# Altium project THE_FIRST.PrjPcb (part 1 of 2)
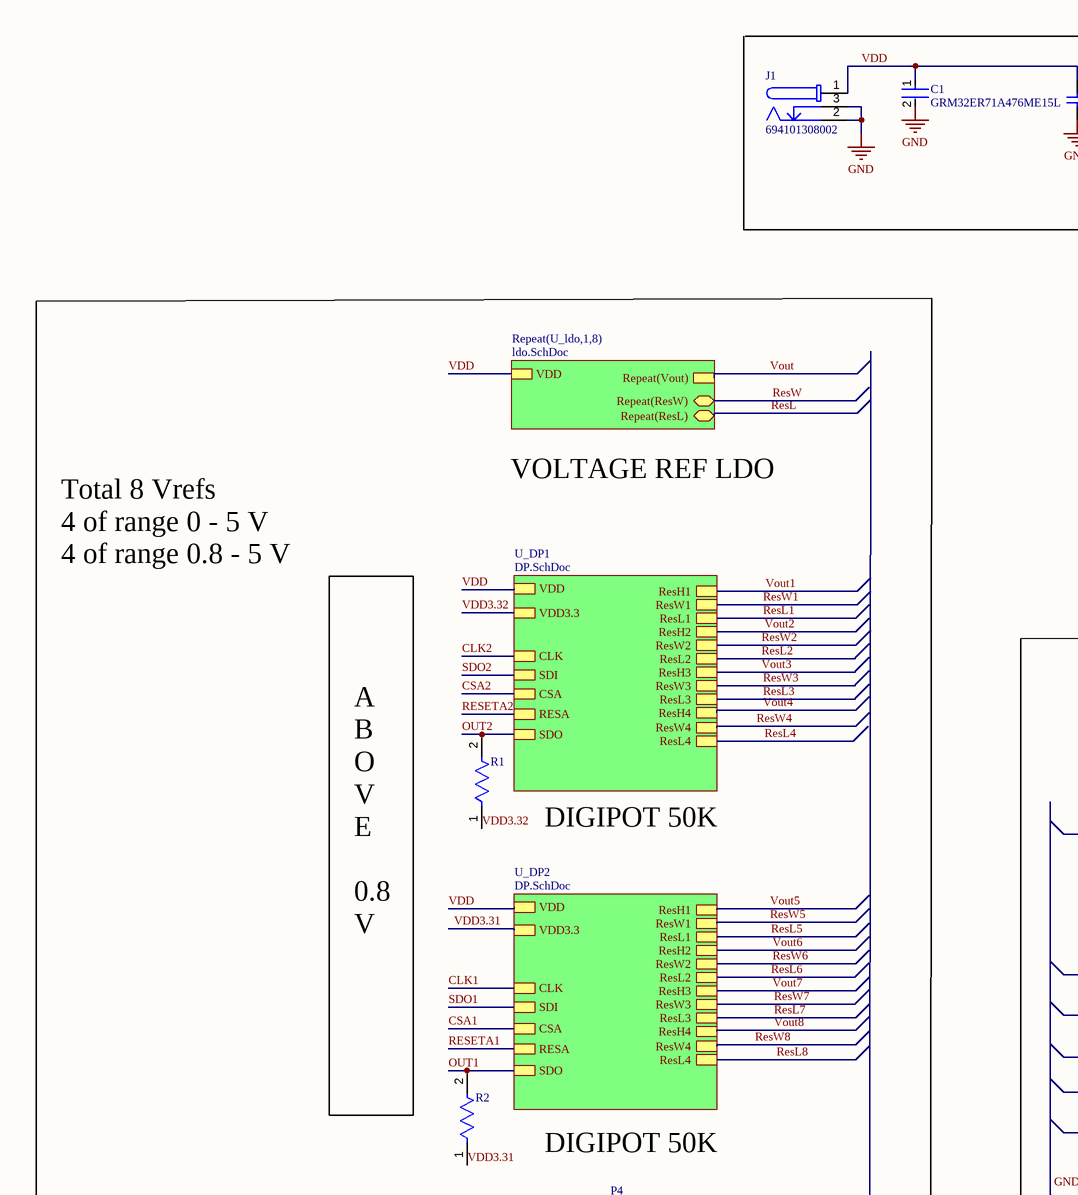
[diagram p0: THE_FIRST.SchDoc, top left]
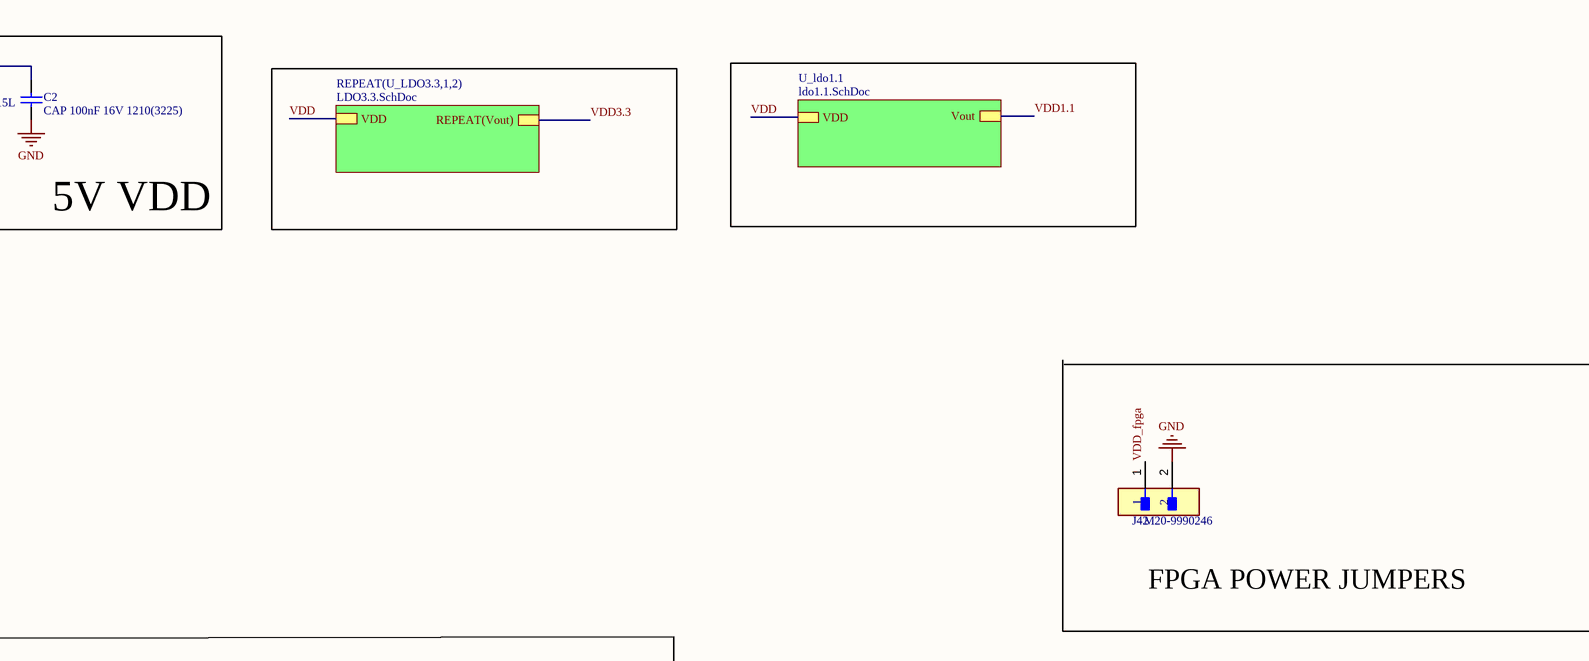
[diagram p1: THE_FIRST.SchDoc, top right]
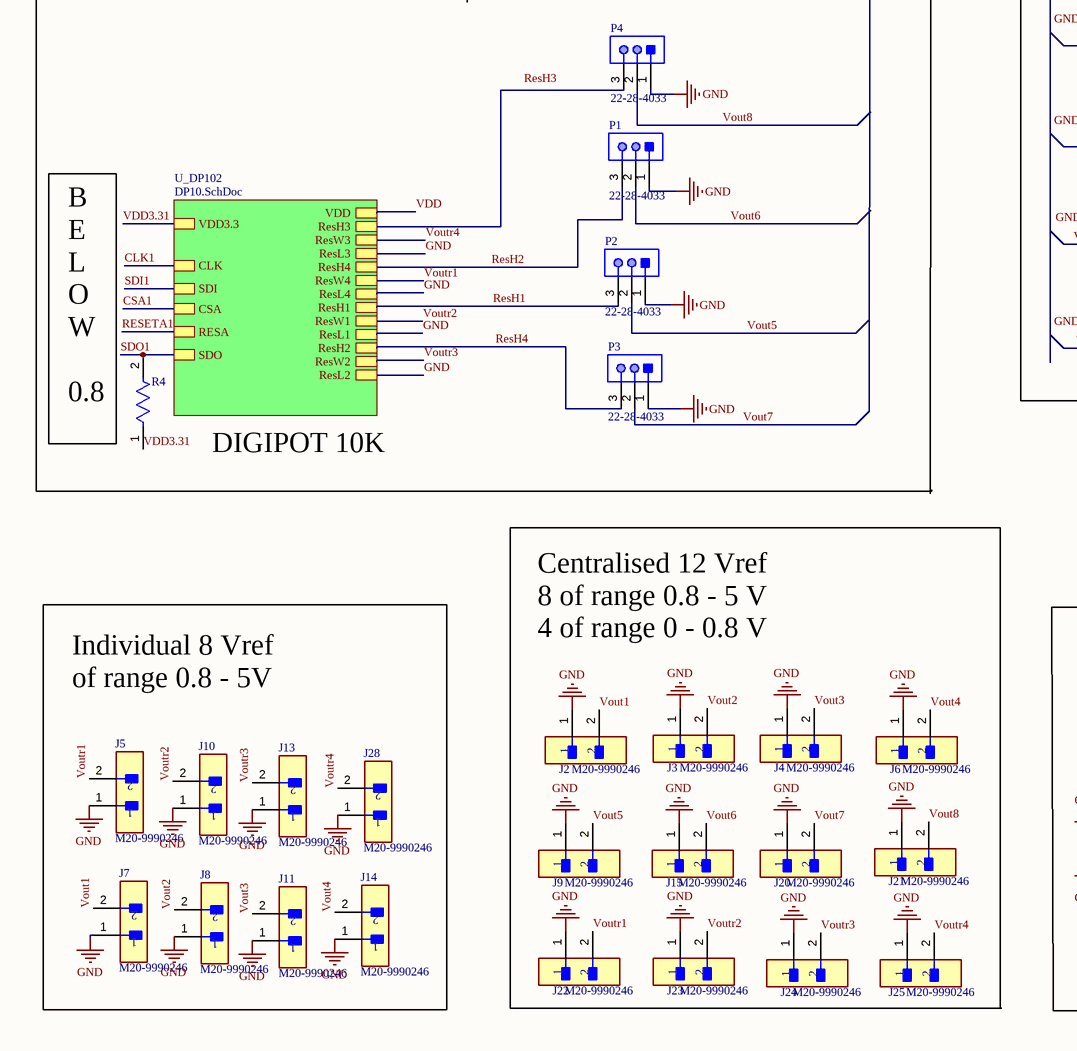
[diagram p2: THE_FIRST.SchDoc, bottom left]
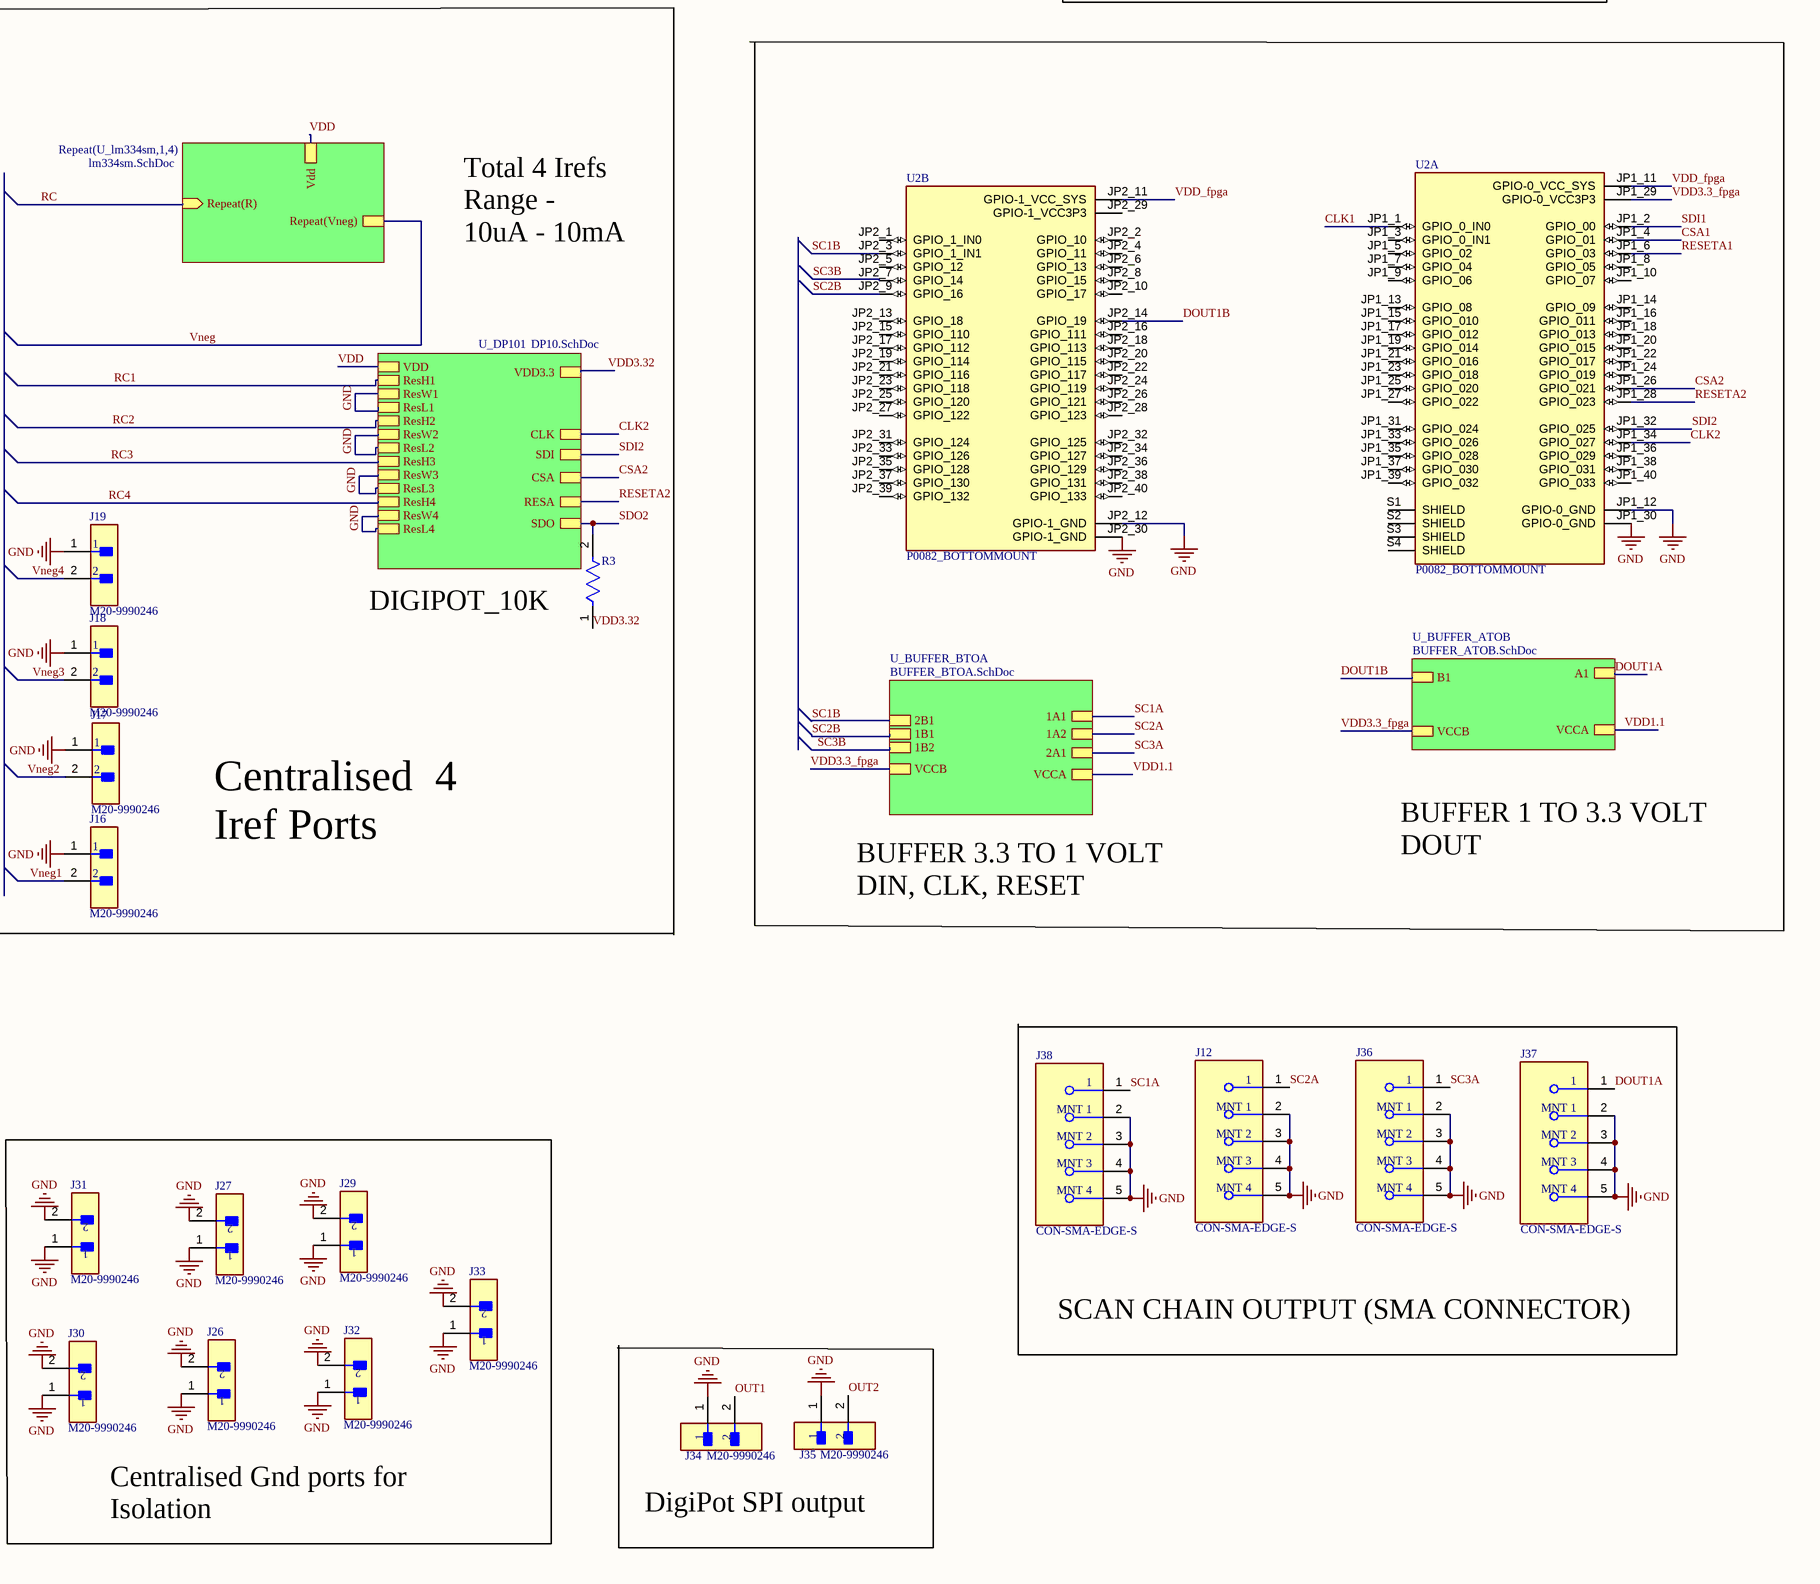
[diagram p3: THE_FIRST.SchDoc, bottom right]
9 sheets, 156 parts. Net scope: hierarchical (ports join the sheet entries above them; power ports are global).
Board file: THE_FIRST.PcbDoc
Sheets:
  THE_FIRST.SchDoc
    U_ldo1 = ldo.SchDoc
    U_ldo2 = ldo.SchDoc
    U_ldo3 = ldo.SchDoc
    U_ldo4 = ldo.SchDoc
    U_ldo5 = ldo.SchDoc
    U_ldo6 = ldo.SchDoc
    U_ldo7 = ldo.SchDoc
    U_ldo8 = ldo.SchDoc
    U_DP1 = DP.SchDoc
    U_DP2 = DP.SchDoc
    U_lm334sm1 = lm334sm.SchDoc
    U_lm334sm2 = lm334sm.SchDoc
    U_lm334sm3 = lm334sm.SchDoc
    U_lm334sm4 = lm334sm.SchDoc
    U_DP101 = DP10.SchDoc
    U_DP102 = DP10.SchDoc
    U_LDO3.31 = LDO3.3.SchDoc
    U_LDO3.32 = LDO3.3.SchDoc
    U_ldo1.1 = ldo1.1.SchDoc
    U_BUFFER_ATOB = BUFFER_ATOB.SchDoc
    U_BUFFER_BTOA = BUFFER_BTOA.SchDoc

## Sheet THE_FIRST.SchDoc
size 558 x 431 mm; DocumentNumber: 1; SheetNumber: 1; SheetTotal: 9

### Parts
C1  GRM32ER71A476ME15L  [FP-GRM32E-0_3-0_2-IPC_A]
C2  CAP 100nF 16V 1210(3225)  [CAPC1210(3225)115_M]
J1  694101308002  [694101308002]
J2  M20-9990246  [FP-M20-9990246-MFG]
J3  M20-9990246  [FP-M20-9990246-MFG]
J4  M20-9990246  [FP-M20-9990246-MFG]
J5  M20-9990246  [FP-M20-9990246-MFG]
J6  M20-9990246  [FP-M20-9990246-MFG]
J7  M20-9990246  [FP-M20-9990246-MFG]
J8  M20-9990246  [FP-M20-9990246-MFG]
J9  M20-9990246  [FP-M20-9990246-MFG]
J10  M20-9990246  [FP-M20-9990246-MFG]
J11  M20-9990246  [FP-M20-9990246-MFG]
J12  CON-SMA-EDGE-S  [FP-CON-SMA-EDGE-S-MFG]
J13  M20-9990246  [FP-M20-9990246-MFG]
J14  M20-9990246  [FP-M20-9990246-MFG]
J15  M20-9990246  [FP-M20-9990246-MFG]
J16  M20-9990246  [FP-M20-9990246-MFG]
J17  M20-9990246  [FP-M20-9990246-MFG]
J18  M20-9990246  [FP-M20-9990246-MFG]
J19  M20-9990246  [FP-M20-9990246-MFG]
J20  M20-9990246  [FP-M20-9990246-MFG]
J21  M20-9990246  [FP-M20-9990246-MFG]
J22  M20-9990246  [FP-M20-9990246-MFG]
J23  M20-9990246  [FP-M20-9990246-MFG]
J24  M20-9990246  [FP-M20-9990246-MFG]
J25  M20-9990246  [FP-M20-9990246-MFG]
J26  M20-9990246  [FP-M20-9990246-MFG]
J27  M20-9990246  [FP-M20-9990246-MFG]
J28  M20-9990246  [FP-M20-9990246-MFG]
J29  M20-9990246  [FP-M20-9990246-MFG]
J30  M20-9990246  [FP-M20-9990246-MFG]
J31  M20-9990246  [FP-M20-9990246-MFG]
J32  M20-9990246  [FP-M20-9990246-MFG]
J33  M20-9990246  [FP-M20-9990246-MFG]
J34  M20-9990246  [FP-M20-9990246-MFG]
J35  M20-9990246  [FP-M20-9990246-MFG]
J36  CON-SMA-EDGE-S  [FP-CON-SMA-EDGE-S-MFG]
J37  CON-SMA-EDGE-S  [FP-CON-SMA-EDGE-S-MFG]
J38  CON-SMA-EDGE-S  [FP-CON-SMA-EDGE-S-MFG]
J42  M20-9990246  [FP-M20-9990246-MFG]
P1  22-28-4033  [MOLX-22-28-4033_V]
P2  22-28-4033  [MOLX-22-28-4033_V]
P3  22-28-4033  [MOLX-22-28-4033_V]
P4  22-28-4033  [MOLX-22-28-4033_V]
R1  ERA-2AEB222X  [FP-ERA2A-MFG]  (value not drawn)
R2  ERA-2AEB222X  [FP-ERA2A-MFG]  (value not drawn)
R3  ERA-2AEB222X  [FP-ERA2A-MFG]  (value not drawn)
R4  ERA-2AEB222X  [FP-ERA2A-MFG]  (value not drawn)
U2  P0082_BOTTOMMOUNT  [MODULE_P0082_BOTTOMMOUNT]  (parts A,B of 2)

### Sub-sheets
REPEAT(U_LDO3.3,1,2) = LDO3.3.SchDoc: VDD, REPEAT(Vout)
Repeat(U_ldo,1,8) = ldo.SchDoc: VDD, Repeat(Vout), Repeat(ResW) (bidir), Repeat(ResL) (bidir)
Repeat(U_lm334sm,1,4) = lm334sm.SchDoc: Vdd, Repeat(R) (in), Repeat(Vneg)
U_BUFFER_ATOB = BUFFER_ATOB.SchDoc: B1, A1, VCCA, VCCB
U_BUFFER_BTOA = BUFFER_BTOA.SchDoc: VCCA, 2B1, 1B1, 1B2, 2A1, 1A1, 1A2, VCCB
U_DP1 = DP.SchDoc: VDD, ResH1, ResW1, ResL1, ResH2, ResW2, ResL2, ResH3, ResW3, ResL3, ResH4, ResW4, ResL4, VDD3.3, CLK, SDI, CSA, RESA, SDO
U_DP2 = DP.SchDoc: VDD, ResH1, ResW1, ResL1, ResH2, ResW2, ResL2, ResH3, ResW3, ResL3, ResH4, ResW4, ResL4, VDD3.3, CLK, SDI, CSA, RESA, SDO
U_DP101 = DP10.SchDoc: VDD, ResH1, ResW1, ResL1, ResH2, ResW2, ResL2, ResH3, ResW3, ResL3, ResH4, ResW4, ResL4, VDD3.3, CLK, SDI, CSA, RESA, SDO
U_DP102 = DP10.SchDoc: VDD, ResH3, ResW3, ResL3, ResH4, ResW4, ResL4, ResH1, ResW1, ResL1, ResH2, ResW2, ResL2, VDD3.3, CLK, SDI, CSA, RESA, SDO
U_ldo1.1 = ldo1.1.SchDoc: VDD, Vout

### Nets
GND: C1.2 C2.1 J1.2 J1.3 J2.1 J3.1 J4.1 J5.1 J6.1 J7.1 J8.1 J9.1 J10.1 J11.1 J12.2(MNT_1) J12.3(MNT_2) J12.4(MNT_3) J12.5(MNT_4) J13.1 J14.1 J15.1 J16.1 J17.1 J18.1 J19.1 J20.1 J21.1 J22.1 J23.1 J24.1 J25.1 J26.1 J26.2 J27.1 J27.2 J28.1 J29.1 J29.2 J30.1 J30.2 J31.1 J31.2 J32.1 J32.2 J33.1 J33.2 J34.1 J35.1 J36.2(MNT_1) J36.3(MNT_2) J36.4(MNT_3) J36.5(MNT_4) J37.2(MNT_1) J37.3(MNT_2) J37.4(MNT_3) J37.5(MNT_4) J38.2(MNT_1) J38.3(MNT_2) J38.4(MNT_3) J38.5(MNT_4) J42.2 P1.1 P2.1 P3.1 P4.1 U2.JP1_12(GPIO-0_GND) U2.JP1_30(GPIO-0_GND) U2.JP2_12(GPIO-1_GND) U2.JP2_30(GPIO-1_GND) ; sheet U_DP101/ResW1, sheet U_DP101/ResL1, sheet U_DP101/ResW2, sheet U_DP101/ResL2, sheet U_DP101/ResW3, sheet U_DP101/ResL3, sheet U_DP101/ResW4, sheet U_DP101/ResL4, sheet U_DP102/ResL3, sheet U_DP102/ResL4, sheet U_DP102/ResL1, sheet U_DP102/ResL2
CLK1: U2.JP1_1(GPIO_0_IN0) ; sheet U_DP2/CLK, sheet U_DP102/CLK
CLK2: U2.JP1_34(GPIO_027) ; sheet U_DP1/CLK, sheet U_DP101/CLK
CSA1: U2.JP1_4(GPIO_01) ; sheet U_DP2/CSA, sheet U_DP102/CSA
CSA2: U2.JP1_26(GPIO_021) ; sheet U_DP1/CSA, sheet U_DP101/CSA
DOUT1A: J37.1 ; sheet U_BUFFER_ATOB/A1
DOUT1B: U2.JP2_14(GPIO_19) ; sheet U_BUFFER_ATOB/B1
OUT1: J34.2 R2.2 ; sheet U_DP2/SDO
OUT2: J35.2 R1.2 ; sheet U_DP1/SDO
RC: sheet Repeat(U_lm334sm,1,4)/Repeat(R)
RESETA1: U2.JP1_6(GPIO_03) ; sheet U_DP2/RESA, sheet U_DP102/RESA
RESETA2: U2.JP1_28(GPIO_023) ; sheet U_DP1/RESA, sheet U_DP101/RESA
ResH1: P2.3 ; sheet U_DP102/ResH1
ResH2: P1.3 ; sheet U_DP102/ResH4
ResH3: P4.3 ; sheet U_DP102/ResH3
ResH4: P3.3 ; sheet U_DP102/ResH2
ResL: sheet Repeat(U_ldo,1,8)/Repeat(ResL)
ResL1: sheet U_DP1/ResW1, sheet U_DP1/ResL1  [also labelled ResW1]
ResL2: sheet U_DP1/ResW2, sheet U_DP1/ResL2  [also labelled ResW2]
ResL3: sheet U_DP1/ResW3, sheet U_DP1/ResL3  [also labelled ResW3]
ResL4: sheet U_DP1/ResW4, sheet U_DP1/ResL4  [also labelled ResW4]
ResL5: sheet U_DP2/ResW1, sheet U_DP2/ResL1  [also labelled ResW5]
ResL6: sheet U_DP2/ResW2, sheet U_DP2/ResL2  [also labelled ResW6]
ResL7: sheet U_DP2/ResW3, sheet U_DP2/ResL3  [also labelled ResW7]
ResL8: sheet U_DP2/ResW4, sheet U_DP2/ResL4  [also labelled ResW8]
ResW: sheet Repeat(U_ldo,1,8)/Repeat(ResW)
SC1A: J38.1 ; sheet U_BUFFER_BTOA/1A1
SC1B: U2.JP2_3(GPIO_1_IN1) ; sheet U_BUFFER_BTOA/2B1
SC2A: J12.1 ; sheet U_BUFFER_BTOA/1A2
SC2B: U2.JP2_9(GPIO_16) ; sheet U_BUFFER_BTOA/1B1
SC3A: J36.1 ; sheet U_BUFFER_BTOA/2A1
SC3B: U2.JP2_7(GPIO_14) ; sheet U_BUFFER_BTOA/1B2
SDI1: U2.JP1_2(GPIO_00) ; sheet U_DP102/SDI
SDI2: U2.JP1_32(GPIO_025) ; sheet U_DP101/SDI
SDO1: R4.2 ; sheet U_DP2/SDI, sheet U_DP102/SDO
SDO2: R3.2 ; sheet U_DP1/SDI, sheet U_DP101/SDO
VDD: C1.1 C2.2 J1.1 ; sheet Repeat(U_ldo,1,8)/VDD, sheet U_DP1/VDD, sheet U_DP2/VDD, sheet Repeat(U_lm334sm,1,4)/Vdd, sheet U_DP101/VDD, sheet U_DP102/VDD, sheet REPEAT(U_LDO3.3,1,2)/VDD, sheet U_ldo1.1/VDD
VDD1.1: sheet U_ldo1.1/Vout, sheet U_BUFFER_ATOB/VCCA, sheet U_BUFFER_BTOA/VCCA
VDD3.3: sheet REPEAT(U_LDO3.3,1,2)/REPEAT(Vout)
VDD3.3_fpga: U2.JP1_29(GPIO-0_VCC3P3) ; sheet U_BUFFER_ATOB/VCCB, sheet U_BUFFER_BTOA/VCCB
VDD3.31: R2.1 R4.1 ; sheet U_DP2/VDD3.3, sheet U_DP102/VDD3.3
VDD3.32: R1.1 R3.1 ; sheet U_DP1/VDD3.3, sheet U_DP101/VDD3.3
VDD_fpga: J42.1 U2.JP1_11(GPIO-0_VCC_SYS) U2.JP2_11(GPIO-1_VCC_SYS)
Vneg: sheet Repeat(U_lm334sm,1,4)/Repeat(Vneg)
Vneg1: J16.2
Vneg2: J17.2
Vneg3: J18.2
Vneg4: J19.2
Vout: sheet Repeat(U_ldo,1,8)/Repeat(Vout)
Vout1: J2.2 J7.2 ; sheet U_DP1/ResH1
Vout2: J3.2 J8.2 ; sheet U_DP1/ResH2
Vout3: J4.2 J11.2 ; sheet U_DP1/ResH3
Vout4: J6.2 J14.2 ; sheet U_DP1/ResH4
Vout5: J9.2 P2.2 ; sheet U_DP2/ResH1
Vout6: J15.2 P1.2 ; sheet U_DP2/ResH2
Vout7: J20.2 P3.2 ; sheet U_DP2/ResH3
Vout8: J21.2 P4.2 ; sheet U_DP2/ResH4
Voutr1: J5.2 J22.2 ; sheet U_DP102/ResW4
Voutr2: J10.2 J23.2 ; sheet U_DP102/ResW1
Voutr3: J13.2 J24.2 ; sheet U_DP102/ResW2
Voutr4: J25.2 J28.2 ; sheet U_DP102/ResW3

Not connected (* = marked no-connect by the designer): U2 JP1_3(GPIO_0_IN1) JP1_5(GPIO_02) JP1_7(GPIO_04) JP1_8(GPIO_05) JP1_9(GPIO_06) JP1_10(GPIO_07) JP1_13(GPIO_08) JP1_14(GPIO_09) JP1_15(GPIO_010) JP1_16(GPIO_011) JP1_17(GPIO_012) JP1_18(GPIO_013) JP1_19(GPIO_014) JP1_20(GPIO_015) JP1_21(GPIO_016) JP1_22(GPIO_017) JP1_23(GPIO_018) JP1_24(GPIO_019) JP1_25(GPIO_020) JP1_27(GPIO_022) JP1_31(GPIO_024) JP1_33(GPIO_026) JP1_35(GPIO_028) JP1_36(GPIO_029) JP1_37(GPIO_030) JP1_38(GPIO_031) JP1_39(GPIO_032) JP1_40(GPIO_033) JP2_1(GPIO_1_IN0) JP2_2(GPIO_10) JP2_4(GPIO_11) JP2_5(GPIO_12) JP2_6(GPIO_13) JP2_8(GPIO_15) JP2_10(GPIO_17) JP2_13(GPIO_18) JP2_15(GPIO_110) JP2_16(GPIO_111) JP2_17(GPIO_112) JP2_18(GPIO_113) JP2_19(GPIO_114) JP2_20(GPIO_115) JP2_21(GPIO_116) JP2_22(GPIO_117) JP2_23(GPIO_118) JP2_24(GPIO_119) JP2_25(GPIO_120) JP2_26(GPIO_121) JP2_27(GPIO_122) JP2_28(GPIO_123) JP2_29(GPIO-1_VCC3P3) JP2_31(GPIO_124) JP2_32(GPIO_125) JP2_33(GPIO_126) JP2_34(GPIO_127) JP2_35(GPIO_128) JP2_36(GPIO_129) JP2_37(GPIO_130) JP2_38(GPIO_131) JP2_39(GPIO_132) JP2_40(GPIO_133) S1(SHIELD) S2(SHIELD) S3(SHIELD) S4(SHIELD)

### Notes on the sheet
- 5V VDD
- 3.3V VDD
- 1.1V VDD
- V Refs
- VOLTAGE REF LDO
- Total 8 Vrefs
  4 of range 0 - 5 V
  4 of range 0.8 - 5 V
- FPGA POWER JUMPERS
- CURRENT Refs
- FPGA BOARD
- DIGIPOT 50K
- Total 4 Irefs
  Range -
  10uA - 10mA
- A
  B
  O
  V
  E
  0.8
  V
- (near R3) DIGIPOT_10K
- Centralised  4
  Iref Ports
- BUFFER 3.3 TO 1 VOLT
  DIN, CLK, RESET
- BUFFER 1 TO 3.3 VOLT
  DOUT
- (near R4) B
  E
  L
  O
  W
  0.8
  V
- DIGIPOT 10K
- Centralised 12 Vref
  8 of range 0.8 - 5 V
  4 of range 0 - 0.8 V
- Individual 8 Vref
  of range 0.8 - 5V
- SCAN CHAIN OUTPUT (SMA CONNECTOR)
- Centralised Gnd ports for Isolation
- DigiPot SPI output
- Labels drawn without touching a wire or pin: ResH3
- DWG. NO.
- REV.
- SHT.
- REVISION
- DESCRIPTION
- DATE
- APPROVED
- THIS DOCUMENT AND THE DATA DISCLOSED HEREIN OR HEREWITH IS THE PROPERTY OF ALTIUM LIMITED AND MAY BE FREELY DISTRIBUTED IN WHOLE. NO RIGHTS ARE RESERVED OR EXPRESS OR IMPLIED WARANTEE GIVEN.
- ENG:
- DSN:
- APPROVALS
- PROJECT
- DOCUMENT REVISION:
- DESIGN ITEM:
- CHK:
- BOM:
- REFERENCE DOCUMENTS
- PROJECT REVISION:
- TITLE
- FAB DWG:
- PCB DWG:
- ASSY DWG:
- SCALE:
- SIZE
- C
- CAGE CODE
- FILE NAME
- DWG NO.
- SHEET
- OF
- REV

### Library data of the parts
C1 = CMP-2000-06363-3: Chip Multilayer Ceramic Capacitors for General Purpose, 1210, 47uF, X7R, 15%, 20%, 10V; Voltage Rating (DC): 10V; Lead Free: Lead Free; Capacitance: 47uF; Max Operating Temperature: 125°C; Height: 2.5mm; Min Operating Temperature: -55°C; Length: 3.2mm; Package Quantity: 1; Termination: SMD/SMT; Case Code (Imperial): 1210; Width: 0.098inch; Voltage Rating: 10V; Thickness: 0.106inch; Depth: 2.5mm; REACH SVHC: No SVHC; Packaging: Tape and Reel; Dielectric: X7R; Voltage: 10V; Radiation Hardening: No; Case Code (Metric): 3225; Tolerance: 20%; Case/Package: 1210; Mount: Surface Mount
C2 = CMP-1038-01632-1: CAP 100nF 16V ±1% 1210 (3225 Metric) Thickness 1.1mm SMD; Manufacturer: Panasonic; Manufacturer Part Number: ECH-U1C104GX5; Case-Metric: 3225; Tolerance: Â±1%; Case-EIA: 1210; Dielectric Material: Polyphenylene; Capacitor Type: FILM; Tolerance  (fill in as +-): 2%; Value: 100nF; Technology: SMT; Max Thickness: 1.1 mm; Rated Voltage: 16 V; Supplier: Digikey; Supplier Part Number: PCF1189CT-ND; RoHS: Yes; Category: Film Capacitors; Stock: 18597; Pricing: 1=1, 10=0.637, 50=0.4958, 100=0.4521, 500=0.37836, 1000=0.35557 (USD); Mounting Technology: Surface Mount; Pins: 2; Case/Package: 1210; Package Shape: Rectangular; Terminal Finish: Copper; Min Operating Temperature: -55°C; Max Operating Temperature: 125°C; Package Style: SMTMeter; Packaging: Tape and Reel; Tolerance (fill in as +-): 2%; Rated DC Voltage (URdc): 16V; JESD-609 Code: e1; Termination: Wraparound; Length: 3.2mm; Width: 2.5mm; Height: 2.1mm; Reach SVHC Compliant: Yes; RoHS Compliant: Yes; ComponentLink1URL: https://datasheet.ciiva.com:443/pdfs/VipMasterIC/IC/PANA/PANA-S-A0009590914/PANA-S-A0009590914-1.pdf?src-supplier=IHS+Markit; ComponentLink1Description: https://datasheet.ciiva.com:443/pdfs/VipMasterIC/IC/PANA/PANA-S-A0009590914/PANA-S-A0009590914-1.pdf?src-supplier=IHS+Markit; ComponentLink2URL: https://datasheet.ciiva.com/11792/0900766b8016ecc7-11792269.pdf?src-supplier=Rs; ComponentLink2Description: https://datasheet.ciiva.com/11792/0900766b8016ecc7-11792269.pdf?src-supplier=Rs; ComponentLink3URL: https://datasheet.ciiva.com/11416/abd0000ce13-11416261.pdf?src-supplier=Avnet; ComponentLink3Description: https://datasheet.ciiva.com/11416/abd0000ce13-11416261.pdf?src-supplier=Avnet; ComponentLink4URL: https://datasheet.ciiva.com/30113/21abd0000ce13-30113725.pdf?src-supplier=Onlinecomponents.com; ComponentLink4Description: https://datasheet.ciiva.com/30113/21abd0000ce13-30113725.pdf?src-supplier=Onlinecomponents.com; ComponentLink5URL: https://datasheet.ciiva.com/14606/70067901-14606805.pdf?src-supplier=Allied+Electronics; ComponentLink5Description: https://datasheet.ciiva.com/14606/70067901-14606805.pdf?src-supplier=Allied+Electronics; ComponentLink6URL: https://datasheet.ciiva.com/27055/1981672-27055573.pdf?src-supplier=Jameco; ComponentLink6Description: https://datasheet.ciiva.com/27055/1981672-27055573.pdf?src-supplier=Jameco
J1 = CMP-1502-00182-2: NexarPartId: 52676095; Voltage Rating: 12V; Connector Type: Power; Gender: Male; Insulation Resistance: 100MΩ; Current Rating: 2A; Shielding: Unshielded; Max Operating Temperature: 85°C; Housing Material: Polyamide; RoHS: Compliant; Color: Black; Voltage Rating (DC): 12V; Contact Plating: Tin; Min Operating Temperature: -20°C; Operating Supply Voltage: 12V; REACH SVHC: Unknown; Mount: Through Hole; Termination: Through Hole; Flammability Rating: UL94 V-0; Contact Gender: Male; Packaging: Bulk
J2-J11 J13-J35 J42 = CMP-15831-000009-1: CONN HEADER VERT 2POS 2.54MM; Manufacturer: Harwin; Conn Gender: Male; Conn Orientation: Vertical; Number Of Contacts: 2; Current Rating: 3A; ComponentLink2URL: https://cdn.harwin.com/pdfs/M20-999.pdf; ComponentLink2Description: Datasheet; Package: M20-9990246; Temperature: -40°C to +105°C; Octopart: https://octopart.com/m20-9990246-harwin-2590635; Mouser Description: 2.54mm (0.1") Pitch SIL Vertical PC Tail Pin Header, 6.1mm mating pin height, tin, 2 contacts; Temperature Range High: +105°C; Device Class L1: Connectors; RoHS: TRUE; Automotive: No; Height: 8.99mm; Number Of Rows: 1; Contact Material: Tin,Nickel; Category: Conn; Pitch: 2.54mm; Lead Free: Yes; Digikey Description: CONN HEADER VERT 2POS 2.54MM; Manufacturer Part Number: M20-9990246; Temperature Range Low: -40°C; Device Class L3: unset; Device Class L2: Headers and Wire Housings
J12 J36-J38 = CMP-204357-000001-1: CONN SMA JACK STR EDGE MNT; Manufacturer: RF Solutions Ltd.; Impedance: 50Ω; Conn Orientation: Right Angle; Is Female: yes; Number Of Contacts: 1; Frequency: 18GHz; Shielding: true; Category: Conn; ComponentLink2URL: https://www.rfsolutions.co.uk/downloads/1498648656DS-CON-EDGE-SMA-4.pdf; Octopart: https://octopart.com/con-sma-edge-s-rf+solutions-70967450; Package: CONN_JACK; Manufacturer Part Number: CON-SMA-EDGE-S; Height: 6.35mm; Device Class L1: Connectors; Footprint Url: https://forum.upverter.com/uploads/default/original/3X/b/e/be75b907af57498775929d6d9099689c472e0307.pdf; Contact Material: Gold; ComponentLink2Description: Datasheet; Device Class L2: RF / Coaxial Connectors; RoHS: TRUE; Device Class L3: unset; Digikey Description: CONN SMA JACK STR EDGE MNT; Lead Free: Yes; Automotive: No; Supplier: Mouser; Supplier Part Number: 223-CON-SMA-EDGE-S; Stock: 609; Pricing: 1=2.52, 10=2.14, 50=1.91, 100=1.82, 1000=1.54, 10000=1.45 (USD); ComponentLink1URL: https://media.digikey.com/pdf/Data%20Sheets/RF%20Solutions%20PDFs/CON-SMA-EDGE.pdf?src-supplier=Digikey; ComponentLink1Description: https://media.digikey.com/pdf/Data%20Sheets/RF%20Solutions%20PDFs/CON-SMA-EDGE.pdf?src-supplier=Digikey; ComponentLink3URL: https://datasheet.octopart.com/CON-SMA-EDGE-S-RF-Solutions-datasheet-153593425.pdf?src-supplier=Element14; ComponentLink3Description: https://datasheet.octopart.com/CON-SMA-EDGE-S-RF-Solutions-datasheet-153593425.pdf?src-supplier=Element14
P1-P4 = CMP-1676-00001-5: Male Header, Pitch 2.54 mm, 1 x 3 Position, Height 8.38 mm, Tail Length 3.18 mm, RoHS, Bulk; Manufacturer: Molex; Rows: 1; Voltage Rating: 250 V; Current Rating: 4 A; Min Operating Temperature: 0 degC; Lead Pitch: 0.1 inch; Packaging: Bulk; Contact Finish: Gold; RoHSCompliant: true; Contact Material: Brass; PackageReference: 22-28-4033; REACH SVHC: Unknown; PackageDescription: Male Header, Pitch 2.54 mm, 1 x 3 Position, Height 8.38 mm, Tail Length 3.18 mm; ComponentLink2URL: http://www.molex.com/pdm_docs/sd/022284033_sd.pdf; Height: 8.38 mm; Mounting Technology: Through Hole; ComponentLink1Description: Manufacturer URL; Length: 7.62 mm; Mount: Through Hole; DatasheetVersion: Rev. G, 01/2012; Max Operating Temperature: 75 degC; ComponentLink2Description: Datasheet; Colour: Black; Pins: 3; Contact Plating: Gold; Package Quantity: 1; ComponentLink1URL: http://www.molex.com/
R1-R4 = CMP-2002-05881-2: RES SMD 2.2K OHM 0.1% 1/16W 0402; Manufacturer: Panasonic; Temperature Coefficient: 25ppm/°C; Power Rating: 0.063W; Value: 2.2kΩ; Voltage Rating: 50V; Automotive Grade: Grade 0; Automotive: Yes; Device Class L1: Passive Components; Tolerance: 0.1%; Digikey Description: RES SMD 2.2K OHM 0.1% 1/16W 0402; Device Class L2: Resistors; Manufacturer Part Number: ERA-2AEB222X; Octopart: https://octopart.com/era-2aeb222x-panasonic-9251391; ComponentLink2Description: Datasheet; Ipc Land Pattern Name: RESC10050X35; Package: ERA2A; Height: 0.4mm; ComponentLink2URL: https://industrial.panasonic.com/cdbs/www-data/pdf/RDM0000/AOA0000C307.pdf; Temperature Range High: +155°C; Device Class L3: Chip SMD Resistors; Temperature Range Low: -55°C; Lead Free: Yes; Mouser Description: Thin Film Resistors - SMD 0402 1/16W 2.2Kohms; Footprint Url: https://b2b-api.panasonic.eu/file_stream/pids/fileversion/1079; Temperature: -55°C to +155°C; Category: Res; Resistance: 2.2kΩ; Composition: Metal Film; Series: E24; RoHS: TRUE
U2 = P0082_BOTTOMMOUNT: Cyclone IV E FPGA DE0-Nano EP4CE22 CycloneÂ® IV E FPGA Evaluation Board; MF: Terasic Inc.; MP: P0082; SnapEDA_Link: https://www.snapeda.com/parts/P0082/Terasic+Inc./view-part/?ref=snap; Package: None; Value: *; Check_prices: https://www.snapeda.com/parts/P0082/Terasic+Inc./view-part/?ref=eda

## Sheet ldo.SchDoc
size A4; SheetNumber: 2; SheetTotal: 9
Used 8 times, as channels U_ldo1, U_ldo2, U_ldo3, U_ldo4, U_ldo5, U_ldo6, U_ldo7, U_ldo8. Parts and nets are listed once, with the designators drawn on the sheet.
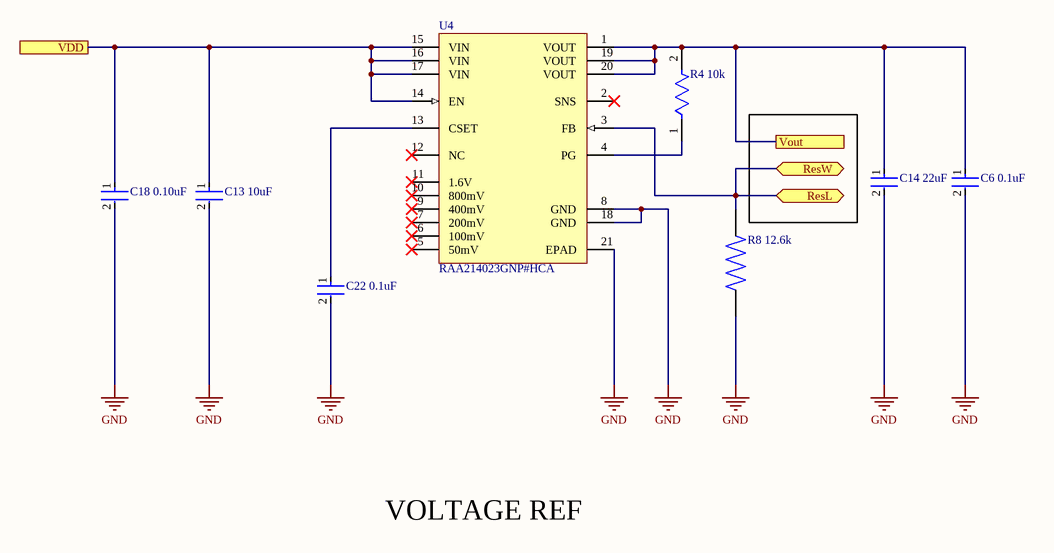
[diagram p4: ldo.SchDoc]

### Parts
C6_0.1uF  C0805C104K4RAC  [FP-C0805C-DN-MFG]  (value not drawn)
C13_10uF  CL21A106KOQNNNG  [FP-CL21-IPC_C]  (value not drawn)
C14_22uF  CL21A226MOCLRNC  [FP-CL21-IPC_C]  (value not drawn)
C18_0.10uF  C0805C104K4RAC  [FP-C0805C-DN-MFG]  (value not drawn)
C22_0.1uF  C0805C104K4RAC  [FP-C0805C-DN-MFG]  (value not drawn)
R4_10k  RC1005F103CS  [FP-RC1005-IPC_B]  (value not drawn)
R8_12.6k  RN73R1ETTP1262B25  [RESC1005X40N]  (value not drawn)
U4  RAA214023GNP#HCA  [L20_3_5x3_5_MFG]

### Ports
ResL (bidir, see THE_FIRST[8G]), ResW (bidir, see THE_FIRST[8G]), VDD (see THE_FIRST[9G], DP10[1B], DP[2B], ldo1.1[1B], LDO3.3[1B], lm334sm[2B]), Vout (see THE_FIRST[8G])

### Nets
GND: C6_0.1uF.2 C13_10uF.2 C14_22uF.2 C18_0.10uF.2 C22_0.1uF.2 R8_12.6k.1 U4.8(GND) U4.18(GND) U4.21(EPAD)
ResL: R8_12.6k.2 U4.3(FB) ; port ResW, port ResL
VDD: C13_10uF.1 C18_0.10uF.1 U4.14(EN) U4.15(VIN) U4.16(VIN) U4.17(VIN) ; port VDD
Vout: C6_0.1uF.1 C14_22uF.1 R4_10k.2 U4.1(VOUT) U4.19(VOUT) U4.20(VOUT) ; port Vout
NetC22_0.1uF_1: C22_0.1uF.1 U4.13(CSET)
NetR4_10k_1: R4_10k.1 U4.4(PG)

Not connected (* = marked no-connect by the designer): U4 2(SNS)* 5(50mV)* 6(100mV)* 7(200mV)* 9(400mV)* 10(800mV)* 11(1.6V)* 12(NC)*

### Channels
U_ldo1: designators C6 0.1uF=C6_0.1uFA C13 10uF=C13_10uFA C14 22uF=C14_22uFA C18 0.10uF=C18_0.10uFA C22 0.1uF=C22_0.1uFA R4 10k=R4_10kA R8 12.6k=R8_12.6kA U4=U4A; ports ResL=ResL1 ResW=ResL1 VDD=VDD Vout=Vout1
U_ldo2: designators C6 0.1uF=C6_0.1uFB C13 10uF=C13_10uFB C14 22uF=C14_22uFB C18 0.10uF=C18_0.10uFB C22 0.1uF=C22_0.1uFB R4 10k=R4_10kB R8 12.6k=R8_12.6kB U4=U4B; ports ResL=ResL2 ResW=ResL2 VDD=VDD Vout=Vout2
U_ldo3: designators C6 0.1uF=C6_0.1uFC C13 10uF=C13_10uFC C14 22uF=C14_22uFC C18 0.10uF=C18_0.10uFC C22 0.1uF=C22_0.1uFC R4 10k=R4_10kC R8 12.6k=R8_12.6kC U4=U4C; ports ResL=ResL3 ResW=ResL3 VDD=VDD Vout=Vout3
U_ldo4: designators C6 0.1uF=C6_0.1uFD C13 10uF=C13_10uFD C14 22uF=C14_22uFD C18 0.10uF=C18_0.10uFD C22 0.1uF=C22_0.1uFD R4 10k=R4_10kD R8 12.6k=R8_12.6kD U4=U4D; ports ResL=ResL4 ResW=ResL4 VDD=VDD Vout=Vout4
U_ldo5: designators C6 0.1uF=C6_0.1uFE C13 10uF=C13_10uFE C14 22uF=C14_22uFE C18 0.10uF=C18_0.10uFE C22 0.1uF=C22_0.1uFE R4 10k=R4_10kE R8 12.6k=R8_12.6kE U4=U4E; ports ResL=ResL5 ResW=ResL5 VDD=VDD Vout=Vout5
U_ldo6: designators C6 0.1uF=C6_0.1uFF C13 10uF=C13_10uFF C14 22uF=C14_22uFF C18 0.10uF=C18_0.10uFF C22 0.1uF=C22_0.1uFF R4 10k=R4_10kF R8 12.6k=R8_12.6kF U4=U4F; ports ResL=ResL6 ResW=ResL6 VDD=VDD Vout=Vout6
U_ldo7: designators C6 0.1uF=C6_0.1uFG C13 10uF=C13_10uFG C14 22uF=C14_22uFG C18 0.10uF=C18_0.10uFG C22 0.1uF=C22_0.1uFG R4 10k=R4_10kG R8 12.6k=R8_12.6kG U4=U4G; ports ResL=ResL7 ResW=ResL7 VDD=VDD Vout=Vout7
U_ldo8: designators C6 0.1uF=C6_0.1uFH C13 10uF=C13_10uFH C14 22uF=C14_22uFH C18 0.10uF=C18_0.10uFH C22 0.1uF=C22_0.1uFH R4 10k=R4_10kH R8 12.6k=R8_12.6kH U4=U4H; ports ResL=ResL8 ResW=ResL8 VDD=VDD Vout=Vout8

### Notes on the sheet
- VOLTAGE REF

### Library data of the parts
C6_0.1uF C18_0.10uF C22_0.1uF = CMP-03020-009592-2: C0805 0.10 μF X7R 30ppm/°C 10.00% 16 V; Manufacturer: KEMET; Material: Ceramic; Capacitance: 0.10 μF; Tolerance: 0.1; Value: 0.10 μF; Voltage Rating: 16 V; ComponentLink2Description: Datasheet; Category: Cap; Package: C0805C-DN; Device Class L1: Passive Components; Device Class L3: Ceramic Capacitors; RoHS: TRUE; Height: 0.88mm; Automotive: No; Temperature Range High: +125°C; Octopart: https://octopart.com/c0805c104k4rac-kemet-1343167; Mouser Description: Cap Ceramic 0.1uF 16V X7R 10% Pad SMD 0805 125C Bulk; Lead Free: Yes; Temperature Coefficient: 30ppm/°C; Ipc Land Pattern Name: CAPC200125X78; Manufacturer Part Number: C0805C104K4RAC; Temperature Characteristic: X7R; Device Class L2: Capacitors; Temperature Range Low: -55°C; Temperature: -55°C to +125°C; ComponentLink2URL: https://content.kemet.com/datasheets/KEM_C1003_C0G_SMD.pdf
C13_10uF = CMP-13271-002240-1: CL21 Series 0805 10uF 16V ±10% Tolerance X5R Multilayer Ceramic Chip Capacitor; Capacitance: 10uF; Case Code (Metric): 2012; Package Quantity: 3000; Width: 0.049inch; Mount: Surface Mount; Depth: 1.25mm; Material: Ceramic; Min Operating Temperature: -55°C; Thickness: 0.053inch; Tolerance: 10%; Case Code (Imperial): 0805; Packaging: Tape and Reel; Voltage Rating: 16V; Case/Package: 0805; Height: 1.25mm; Voltage: 16V; Max Operating Temperature: 85°C; Length: 2mm; Dielectric: X5R
C14_22uF = CMP-13271-002990-1: CL21 Series 0805 22uF 16V ±20% Tolerance X5R Multilayer Ceramic Chip Capacitor; Case Code (Imperial): 0805; Capacitance: 22uF; Max Operating Temperature: 85°C; Min Operating Temperature: -55°C; Packaging: Tape and Reel; Case Code (Metric): 2012; Case/Package: 0805; Mount: Surface Mount; Tolerance: 20%; Thickness: 0.037inch; Voltage Rating: 16V; Width: 0.049inch; Length: 0.079inch
R4_10k = CMP-13261-004522-1: Res Thick Film 0402 10kΩ 1% 0.063W ±100ppm/°C Molded SMD T/R; Max Power Dissipation: 63mW; Resistance: 10kR; Power Rating: 62.5mW; Package Quantity: 1; Depth: 0.5mm; Radiation Hardening: No; Features: Moisture Resistant; Max Operating Temperature: 155°C; Case Code (Metric): 1005; Military Standard: Not; Case/Package: 0402; Width: 0.02inch; Contact Plating: Tin; Mount: Surface Mount; Packaging: Tape and Reel; Height: 0.016inch; Case Code (Imperial): 0402; Number of Terminations: 2; Composition: Thick Film; Temperature Coefficient: 100ppm/°C; Min Operating Temperature: -55°C; Tolerance: 1%; Length: 1mm
R8_12.6k = RN73R1ETTP1262B25: Fixed Resistor, Thin Film, 0.063W, 12600ohm, 50V, 0.1% +/-Tol, 25ppm/Cel, Surface Mount, 0402; Manufacturer: KOA Speer; Package: None; Price: None; Value: *; MP: RN73R1ETTP1262B25; Availability: Unavailable; Supplier: Digikey; Supplier Part Number: 2019-RN73R1ETTP1262B25CT-ND; Manufacturer Part Number: RN73R1ETTP1262B25; RoHS: Yes; Category: Chip SMD Resistors; Stock: 8327; Pricing: 1=0.1, 10=0.066, 50=0.0576, 100=0.0544, 500=0.04774, 1000=0.04524, 5000=0.04032 (USD)
U4 = CMP-00572-126438255-2: LDO Voltage Regulators 2A Low Noise LDO, 20 Lead 3.5x3.5 QFN (NiPdAu-Ag lead finish; Manufacturer Lifecycle Status: ACTIVE; Manufacturer: Renesas; Min Output Voltage: 5V; Max Junction Temperature (Tj): 150°C; Dropout Voltage: 420mV; Max Supply Voltage: 5.5V; Output Voltage: 800mV; Quiescent Current: 195µA; Min Supply Voltage: 2.7V; RAM Size: 1.5kB; Pitch: 500µm; Package Body Material: Plastic; Adjustability: ADJUSTABLE; Dropout Voltage1-Max: 570mV; Channels: 1; Output Voltage1-Max: 4.93V; Regulator Type: ADJUSTABLE POSITIVE SINGLE OUTPUT LDO REGULATOR; Case/Package: QFN; Width: 3.5mm; ComponentLink3Description: Manufacturer's Package Drawing; ComponentLink1Description: Manufacturer's Website; HelpURL: https://octopart.com/cad-content/api/get-model-datasheet/15189/126438255; ComponentLink3URL: https://www.renesas.com/en/document/psc/l2035x35-20-lead-quad-flat-no-lead-package-qfn; Height: 900µm; Max Operating Temperature: 85°C; Number of Pins: 20; Max Output Current: 2A; Max Input Voltage: 5.5V; Length: 3.5mm; ComponentLink2URL: https://octopart.com/cad-content/api/get-model-datasheet/15189/126438255; ComponentLink2Description: Datasheet URL; Min Input Voltage: 2.7V; Mount: Surface Mount; Max Output Voltage: 800mV; RoHS: Compliant; ComponentLink1URL: http://www.renesas.com; Min Operating Temperature: -40°C; Lifecycle Status: Production; Supplier: Mouser; Supplier Part Number: 968-RAA214023GNP#HCA; Manufacturer Part Number: RAA214023GNP#HCA; Stock: 3715; Pricing: 1=4.26, 10=2.76, 50=2.36, 100=1.92, 1000=1.45, 10000=1.43 (USD); Mounting Technology: Surface Mount; Pins: 20; Package Shape: Square; Terminal Finish: Gold; Dropout Voltage1-Nom: 420mV; Moisture Sensitivity Level: 1; Number of Outputs: 1; Output Current1-Max: 2A; Output Voltage1-Min: 800mV; Packaging: Tape and Reel; Surface Mount: Yes; Terminal Form: No Lead; Terminal Position: QUAD; Height - Seated (Max): 0.9mm; Terminal Pitch: 0.5mm; Reach SVHC Compliant: Yes; RoHS Compliant: Yes; ComponentLink4URL: https://datasheet.ciiva.com:443/pdfs/VipMasterIC/IC/RNCC/RNCC-S-A0011343211/RNCC-S-A0014920273-1.pdf?src-supplier=IHS+Markit; ComponentLink4Description: https://datasheet.ciiva.com:443/pdfs/VipMasterIC/IC/RNCC/RNCC-S-A0011343211/RNCC-S-A0014920273-1.pdf?src-supplier=IHS+Markit

## Sheet DP.SchDoc
size A4; SheetNumber: 3; SheetTotal: 6
Used 2 times, as channels U_DP1, U_DP2. Parts and nets are listed once, with the designators drawn on the sheet.
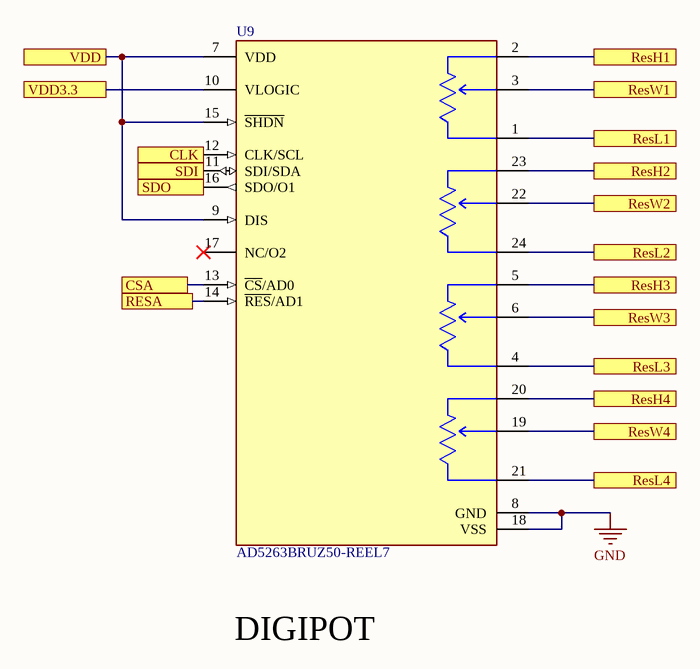
[diagram p5: DP.SchDoc]

### Parts
U9  AD5263BRUZ50-REEL7  [FP-RU-24-IPC_A]

### Ports
CLK (see THE_FIRST[2G], DP10[2B]), CSA (see THE_FIRST[2G], DP10[2B]), RESA (see THE_FIRST[2G], DP10[2B]), ResH1 (see THE_FIRST[1G]), ResH2 (see THE_FIRST[1G]), ResH3 (see THE_FIRST[1G]), ResH4 (see THE_FIRST[1G]), ResL1 (see THE_FIRST[1G]), ResL2 (see THE_FIRST[1G]), ResL3 (see THE_FIRST[1G]), ResL4 (see THE_FIRST[1G]), ResW1 (see THE_FIRST[1G]), ResW2 (see THE_FIRST[1G]), ResW3 (see THE_FIRST[1G]), ResW4 (see THE_FIRST[1G]), SDI (see THE_FIRST[2G]), SDO (see THE_FIRST[2G]), VDD3.3 (see THE_FIRST[2G], DP10[1B]), VDD (see THE_FIRST[2G], DP10[1B], LDO3.3[1B], ldo[1B], lm334sm[2B])

### Nets
GND: U9.8(GND) U9.18(VSS)
CLK: U9.12(CLK/SCL) ; port CLK
CSA: U9.13(~{CS}/AD0) ; port CSA
RESA: U9.14(~{RES}/AD1) ; port RESA
ResH1: U9.2(A1) ; port ResH1
ResH2: U9.23(A2) ; port ResH2
ResH3: U9.5(A3) ; port ResH3
ResH4: U9.20(A4) ; port ResH4
ResL1: U9.1(B1) ; port ResL1
ResL2: U9.24(B2) ; port ResL2
ResL3: U9.4(B3) ; port ResL3
ResL4: U9.21(B4) ; port ResL4
ResW1: U9.3(W1) ; port ResW1
ResW2: U9.22(W2) ; port ResW2
ResW3: U9.6(W3) ; port ResW3
ResW4: U9.19(W4) ; port ResW4
SDI: U9.11(SDI/SDA) ; port SDI
SDO: U9.16(SDO/O1) ; port SDO
VDD: U9.7(VDD) U9.9(DIS) U9.15(~{SHDN}) ; port VDD
VDD3.3: U9.10(VLOGIC) ; port VDD3.3

Not connected (* = marked no-connect by the designer): U9 17(NC/O2)*

### Channels
U_DP1: designators end in A; ports CLK=CLK2 CSA=CSA2 RESA=RESETA2 ResH1=Vout1 ResH2=Vout2 ResH3=Vout3 ResH4=Vout4 ResL1=ResL1 ResL2=ResL2 ResL3=ResL3 ResL4=ResL4 ResW1=ResL1 ResW2=ResL2 ResW3=ResL3 ResW4=ResL4 SDI=SDO2 SDO=OUT2 VDD3.3=VDD3.32 VDD=VDD
U_DP2: designators end in B; ports CLK=CLK1 CSA=CSA1 RESA=RESETA1 ResH1=Vout5 ResH2=Vout6 ResH3=Vout7 ResH4=Vout8 ResL1=ResL5 ResL2=ResL6 ResL3=ResL7 ResL4=ResL8 ResW1=ResL5 ResW2=ResL6 ResW3=ResL7 ResW4=ResL8 SDI=SDO1 SDO=OUT1 VDD3.3=VDD3.31 VDD=VDD

### Notes on the sheet
- DIGIPOT

### Library data of the parts
U9 = CMP-09083-000144-1: IC DGT POT 50KOHM 256TAP 24TSSOP; Operating Supply Voltage: 5V; Memory Type: Volatile; Max Supply Current: 1uA; Frequency: 25MHz; Number of Circuits: 4; Min Supply Voltage: 2.7V; Number of Positions: 256; Temperature Coefficient: 650ppm/°C; Max Dual Supply Voltage: 7.5V; Max Supply Voltage: 16.5V; Min Dual Supply Voltage: 4.5V; Resistance: 50kR; -3db Bandwidth: 300kHz; Interface: I2C; Tolerance: 30%; Lead Free: Contains Lead; Series: -; Dual Supply Voltage: 5V; Operating Supply Current: 1uA; Package Quantity: 1000; RoHS Compliant: Yes; Supply Current: 1uA; Case/Package: TSSOP; Contact Plating: Tin; Nominal Supply Current: 1uA; Mount: Surface Mount; Min Operating Temperature: -40°C; Number of Pins: 24; Taper: Linear; Max Operating Temperature: 125°C; Packaging: Tape and Reel; Number of Elements: 4; Number of Taps: 256

## Sheet lm334sm.SchDoc
size A4; SheetNumber: 4; SheetTotal: 9
Used 4 times, as channels U_lm334sm1, U_lm334sm2, U_lm334sm3, U_lm334sm4. Parts and nets are listed once, with the designators drawn on the sheet.
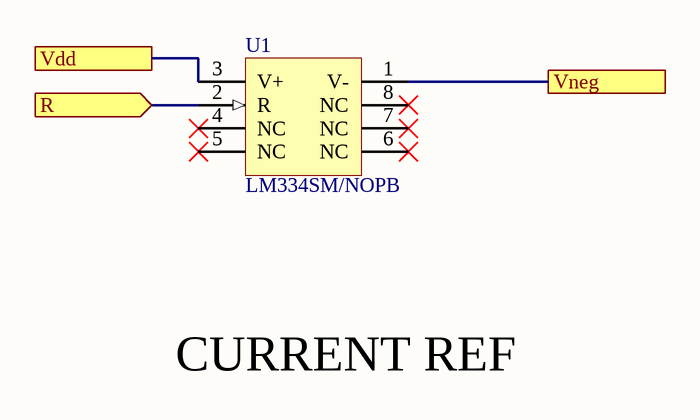
[diagram p6: lm334sm.SchDoc]

### Parts
U1  LM334SM/NOPB  [D0008A_M]

### Ports
R (in, see THE_FIRST[6E]), Vdd (see THE_FIRST[6F], DP10[1B], DP[2B], ldo1.1[1B], LDO3.3[1B], ldo[1B]), Vneg (see THE_FIRST[6E])

### Nets
R: U1.2(R) ; port R
Vdd: U1.3(V+) ; port Vdd
Vneg: U1.1(V-) ; port Vneg

Not connected (* = marked no-connect by the designer): U1 4(NC)* 5(NC)* 6(NC)* 7(NC)* 8(NC)*

### Channels
U_lm334sm1: designators end in A; ports R=RC1 Vdd=VDD Vneg=Vneg1
U_lm334sm2: designators end in B; ports R=RC2 Vdd=VDD Vneg=Vneg2
U_lm334sm3: designators end in C; ports R=RC3 Vdd=VDD Vneg=Vneg3
U_lm334sm4: designators end in D; ports R=RC4 Vdd=VDD Vneg=Vneg4

### Notes on the sheet
- CURRENT REF

### Library data of the parts
U1 = CMP-0063-00597-4: 3-Terminal Adjustable Current Source, 8-pin Narrow SOIC, Pb-Free; Manufacturer: Texas Instruments; High-Reliability: Y; PowerWise: N; PackageTopMarking: NSZXTT*LM334*SM; CompType: MiscPower; ComponentLink1Description: Datasheet URL; PinCount: 8; PackageDescription: SOIC Narrow, 4.9 x 3.9 x 1.45mm, 8 Lead, 1.27mm Pitch; Code_JEDEC: MS-012-AA; Code_IPC: SOIC127P600-8; RoHS: Y; PackageReference: D0008A; ComponentLink1URL: http://www.ti.com/general/docs/lit/getliterature.tsp?genericPartNumber=LM334&fileType=pdf; PartNumber: LM334SM/NOPB

## Sheet DP10.SchDoc
size A4; SheetNumber: 5; SheetTotal: 6
Used 2 times, as channels U_DP101, U_DP102. Parts and nets are listed once, with the designators drawn on the sheet.
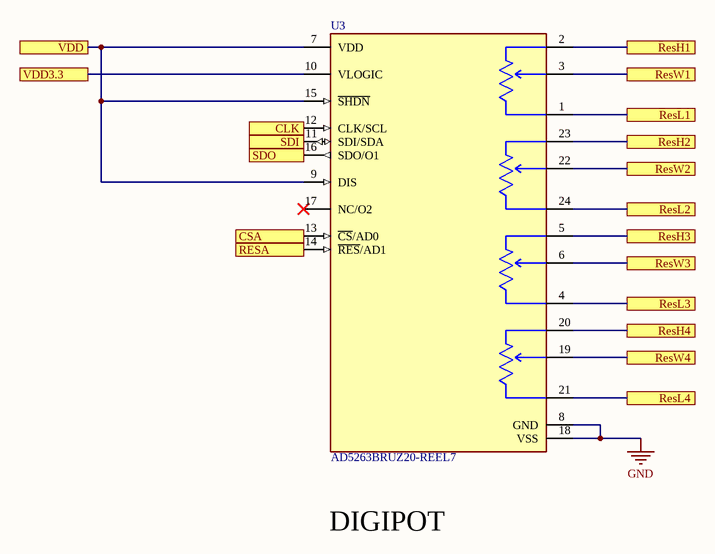
[diagram p7: DP10.SchDoc]

### Parts
U3  AD5263BRUZ20-REEL7  [FP-RU-24-IPC_A]

### Ports
CLK (see THE_FIRST[8D], DP[2B]), CSA (see THE_FIRST[8D], DP[2B]), RESA (see THE_FIRST[8D], DP[2B]), ResH1 (see THE_FIRST[9E]), ResH2 (see THE_FIRST[9D]), ResH3 (see THE_FIRST[9D]), ResH4 (see THE_FIRST[9D]), ResL1 (see THE_FIRST[9D]), ResL2 (see THE_FIRST[9D]), ResL3 (see THE_FIRST[9D]), ResL4 (see THE_FIRST[9D]), ResW1 (see THE_FIRST[9D]), ResW2 (see THE_FIRST[9D]), ResW3 (see THE_FIRST[9D]), ResW4 (see THE_FIRST[9D]), SDI (see THE_FIRST[8D]), SDO (see THE_FIRST[8D]), VDD3.3 (see THE_FIRST[8E], DP[2B]), VDD (see THE_FIRST[9E], DP[2B], LDO3.3[1B], ldo[1B], lm334sm[2B])

### Nets
GND: U3.8(GND) U3.18(VSS)
CLK: U3.12(CLK/SCL) ; port CLK
CSA: U3.13(~{CS}/AD0) ; port CSA
RESA: U3.14(~{RES}/AD1) ; port RESA
ResH1: U3.2(A1) ; port ResH1
ResH2: U3.23(A2) ; port ResH2
ResH3: U3.5(A3) ; port ResH3
ResH4: U3.20(A4) ; port ResH4
ResL1: U3.1(B1) ; port ResL1
ResL2: U3.24(B2) ; port ResL2
ResL3: U3.4(B3) ; port ResL3
ResL4: U3.21(B4) ; port ResL4
ResW1: U3.3(W1) ; port ResW1
ResW2: U3.22(W2) ; port ResW2
ResW3: U3.6(W3) ; port ResW3
ResW4: U3.19(W4) ; port ResW4
SDI: U3.11(SDI/SDA) ; port SDI
SDO: U3.16(SDO/O1) ; port SDO
VDD: U3.7(VDD) U3.9(DIS) U3.15(~{SHDN}) ; port VDD
VDD3.3: U3.10(VLOGIC) ; port VDD3.3

Not connected (* = marked no-connect by the designer): U3 17(NC/O2)*

### Channels
U_DP101: designators end in A; ports CLK=CLK2 CSA=CSA2 RESA=RESETA2 ResH1=RC1 ResH2=RC2 ResH3=RC3 ResH4=RC4 ResL1=GND ResL2=GND ResL3=GND ResL4=GND ResW1=GND ResW2=GND ResW3=GND ResW4=GND SDI=SDI2 SDO=SDO2 VDD3.3=VDD3.32 VDD=VDD
U_DP102: designators end in B; ports CLK=CLK1 CSA=CSA1 RESA=RESETA1 ResH1=ResH1 ResH2=ResH4 ResH3=ResH3 ResH4=ResH2 ResL1=GND ResL2=GND ResL3=GND ResL4=GND ResW1=Voutr2 ResW2=Voutr3 ResW3=Voutr4 ResW4=Voutr1 SDI=SDI1 SDO=SDO1 VDD3.3=VDD3.31 VDD=VDD

### Notes on the sheet
- DIGIPOT

### Library data of the parts
U3 = CMP-09083-000144-1: as U9 on sheet DP; Lead Free: Contains Lead; Series: -; Dual Supply Voltage: 5V; Operating Supply Current: 1uA; Package Quantity: 1000; RoHS Compliant: Yes; Supply Current: 1uA; Case/Package: TSSOP; Contact Plating: Tin; Nominal Supply Current: 1uA; Mount: Surface Mount; Min Operating Temperature: -40°C; Number of Pins: 24; Taper: Linear; Max Operating Temperature: 125°C; Packaging: Tape and Reel; Number of Elements: 4; Number of Taps: 256

## Sheet LDO3.3.SchDoc
size A4; SheetNumber: 6; SheetTotal: 9
Used 2 times, as channels U_LDO3.31, U_LDO3.32. Parts and nets are listed once, with the designators drawn on the sheet.
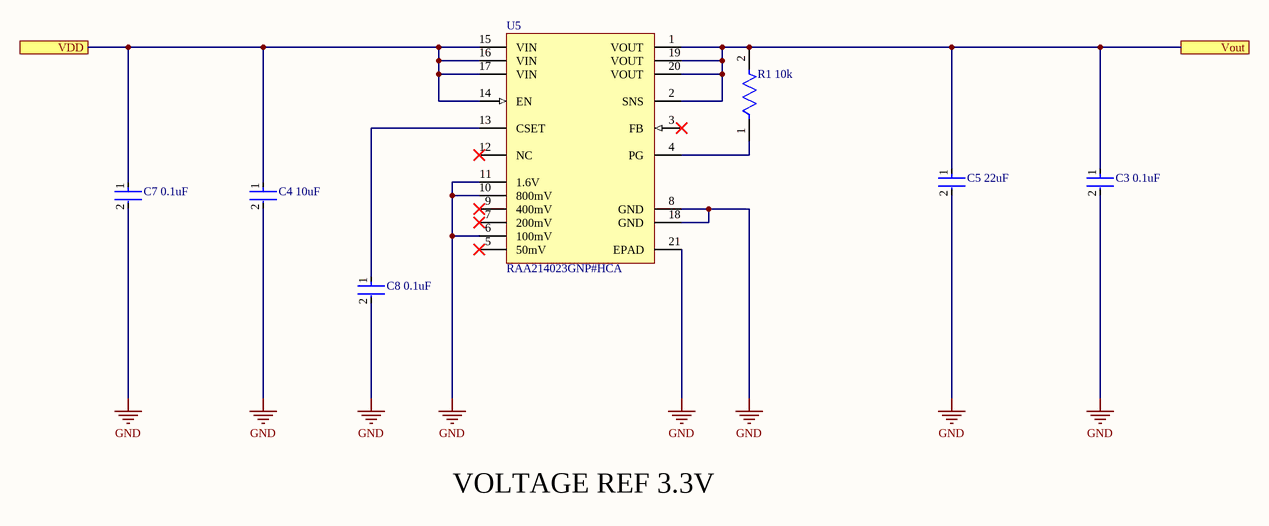
[diagram p8: LDO3.3.SchDoc]

### Parts
C3_0.1uF  C0805C104K4RAC  [FP-C0805C-DN-MFG]  (value not drawn)
C4_10uF  CL21A106KOQNNNG  [FP-CL21-IPC_C]  (value not drawn)
C5_22uF  CL21A226MOCLRNC  [FP-CL21-IPC_C]  (value not drawn)
C7_0.1uF  0.1 uF C0805C104K4RAC  [FP-C0805C-DN-MFG]  (value not drawn)
C8_0.1uF  C0805C104K4RAC  [FP-C0805C-DN-MFG]  (value not drawn)
R1_10k  RC1005F103CS  [FP-RC1005-IPC_B]  (value not drawn)
U5  RAA214023GNP#HCA  [L20_3_5x3_5_MFG]

### Ports
VDD (see THE_FIRST[10G], DP10[1B], DP[2B], ldo1.1[1B], ldo[1B], lm334sm[2B]), Vout (see THE_FIRST[9G])

### Nets
GND: C3_0.1uF.2 C4_10uF.2 C5_22uF.2 C7_0.1uF.2 C8_0.1uF.2 U5.6(100mV) U5.8(GND) U5.10(800mV) U5.11(1.6V) U5.18(GND) U5.21(EPAD)
VDD: C4_10uF.1 C7_0.1uF.1 U5.14(EN) U5.15(VIN) U5.16(VIN) U5.17(VIN) ; port VDD
Vout: C3_0.1uF.1 C5_22uF.1 R1_10k.2 U5.1(VOUT) U5.2(SNS) U5.19(VOUT) U5.20(VOUT) ; port Vout
NetC8_0.1uF_1: C8_0.1uF.1 U5.13(CSET)
NetR1_10k_1: R1_10k.1 U5.4(PG)

Not connected (* = marked no-connect by the designer): U5 3(FB)* 5(50mV)* 7(200mV)* 9(400mV)* 12(NC)*

### Channels
U_LDO3.31: designators C3 0.1uF=C3_0.1uFA C4 10uF=C4_10uFA C5 22uF=C5_22uFA C7 0.1uF=C7_0.1uFA C8 0.1uF=C8_0.1uFA R1 10k=R1_10kA U5=U5A; ports VDD=VDD Vout=VDD3.31
U_LDO3.32: designators C3 0.1uF=C3_0.1uFB C4 10uF=C4_10uFB C5 22uF=C5_22uFB C7 0.1uF=C7_0.1uFB C8 0.1uF=C8_0.1uFB R1 10k=R1_10kB U5=U5B; ports VDD=VDD Vout=VDD3.32

### Notes on the sheet
- VOLTAGE REF 3.3V

### Library data of the parts
C3_0.1uF C8_0.1uF = CMP-03020-009592-2: as C6_0.1uF on sheet ldo; ComponentLink2Description: Datasheet; Category: Cap; Package: C0805C-DN; Device Class L1: Passive Components; Device Class L3: Ceramic Capacitors; RoHS: TRUE; Height: 0.88mm; Automotive: No; Temperature Range High: +125°C; Octopart: https://octopart.com/c0805c104k4rac-kemet-1343167; Mouser Description: Cap Ceramic 0.1uF 16V X7R 10% Pad SMD 0805 125C Bulk; Lead Free: Yes; Temperature Coefficient: 30ppm/°C; Ipc Land Pattern Name: CAPC200125X78; Manufacturer Part Number: C0805C104K4RAC; Temperature Characteristic: X7R; Device Class L2: Capacitors; Temperature Range Low: -55°C; Temperature: -55°C to +125°C; ComponentLink2URL: https://content.kemet.com/datasheets/KEM_C1003_C0G_SMD.pdf
C4_10uF = CMP-13271-002240-1: as C13_10uF on sheet ldo; Capacitance: 10uF; Case Code (Metric): 2012; Package Quantity: 3000; Width: 0.049inch; Mount: Surface Mount; Depth: 1.25mm; Material: Ceramic; Min Operating Temperature: -55°C; Thickness: 0.053inch; Tolerance: 10%; Case Code (Imperial): 0805; Packaging: Tape and Reel; Voltage Rating: 16V; Case/Package: 0805; Height: 1.25mm; Voltage: 16V; Max Operating Temperature: 85°C; Length: 2mm; Dielectric: X5R
C5_22uF = CMP-13271-002990-1: as C14_22uF on sheet ldo; Case Code (Imperial): 0805; Capacitance: 22uF; Max Operating Temperature: 85°C; Min Operating Temperature: -55°C; Packaging: Tape and Reel; Case Code (Metric): 2012; Case/Package: 0805; Mount: Surface Mount; Tolerance: 20%; Thickness: 0.037inch; Voltage Rating: 16V; Width: 0.049inch; Length: 0.079inch
C7_0.1uF = CMP-03020-009592-2: C0805 0.10 μF X7R 30ppm/°C 10.00% 16 V / C0805C104K4RAC; Manufacturer: KEMET; Material: Ceramic; Capacitance: 0.10 μF; Tolerance: 0.1; Value: 0.10 μF; Voltage Rating: 16 V; ComponentLink2Description: Datasheet; Category: Cap; Package: C0805C-DN; Device Class L1: Passive Components; Device Class L3: Ceramic Capacitors; RoHS: TRUE; Height: 0.88mm; Automotive: No; Temperature Range High: +125°C; Octopart: https://octopart.com/c0805c104k4rac-kemet-1343167; Mouser Description: Cap Ceramic 0.1uF 16V X7R 10% Pad SMD 0805 125C Bulk; Lead Free: Yes; Temperature Coefficient: 30ppm/°C; Ipc Land Pattern Name: CAPC200125X78; Manufacturer Part Number: C0805C104K4RAC; Temperature Characteristic: X7R; Device Class L2: Capacitors; Temperature Range Low: -55°C; Temperature: -55°C to +125°C; ComponentLink2URL: https://content.kemet.com/datasheets/KEM_C1003_C0G_SMD.pdf
R1_10k = CMP-13261-004522-1: as R4_10k on sheet ldo; Package Quantity: 1; Depth: 0.5mm; Radiation Hardening: No; Features: Moisture Resistant; Max Operating Temperature: 155°C; Case Code (Metric): 1005; Military Standard: Not; Case/Package: 0402; Width: 0.02inch; Contact Plating: Tin; Mount: Surface Mount; Packaging: Tape and Reel; Height: 0.016inch; Case Code (Imperial): 0402; Number of Terminations: 2; Composition: Thick Film; Temperature Coefficient: 100ppm/°C; Min Operating Temperature: -55°C; Tolerance: 1%; Length: 1mm
U5 = CMP-00572-126438255-2: LDO Voltage Regulators 2A Low Noise LDO, 20 Lead 3.5x3.5 QFN (NiPdAu-Ag lead finish; Manufacturer Lifecycle Status: ACTIVE; Min Output Voltage: 5V; Max Junction Temperature (Tj): 150°C; Dropout Voltage: 420mV; Max Supply Voltage: 5.5V; Output Voltage: 800mV; Quiescent Current: 195µA; Min Supply Voltage: 2.7V; RAM Size: 1.5kB; Pitch: 500µm; Case/Package: QFN; Width: 3.5mm; ComponentLink3Description: Manufacturer's Package Drawing; ComponentLink1Description: Manufacturer's Website; HelpURL: https://octopart.com/cad-content/api/get-model-datasheet/15189/126438255; ComponentLink3URL: https://www.renesas.com/en/document/psc/l2035x35-20-lead-quad-flat-no-lead-package-qfn; Height: 900µm; Max Operating Temperature: 85°C; Number of Pins: 20; Max Output Current: 2A; Max Input Voltage: 5.5V; Length: 3.5mm; ComponentLink2URL: https://octopart.com/cad-content/api/get-model-datasheet/15189/126438255; ComponentLink2Description: Datasheet URL; Min Input Voltage: 2.7V; Mount: Surface Mount; Max Output Voltage: 800mV; RoHS: Compliant; ComponentLink1URL: http://www.renesas.com; Min Operating Temperature: -40°C; Lifecycle Status: Production

## Sheet ldo1.1.SchDoc
size A4; SheetNumber: 7; SheetTotal: 9
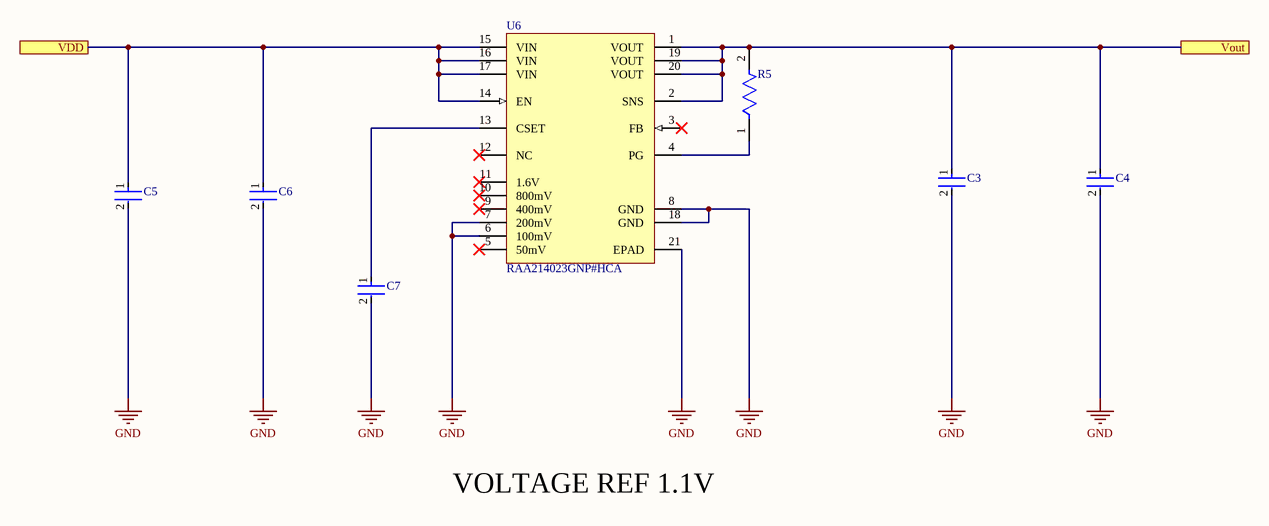
[diagram p9: ldo1.1.SchDoc]

### Parts
C3  CL21A226MOCLRNC  [FP-CL21-IPC_C]  (value not drawn)
C4  C0805C104K4RAC  [FP-C0805C-DN-MFG]  (value not drawn)
C5  0.1 uF C0805C104K4RAC  [FP-C0805C-DN-MFG]  (value not drawn)
C6  CL21A106KOQNNNG  [FP-CL21-IPC_C]  (value not drawn)
C7  C0805C104K4RAC  [FP-C0805C-DN-MFG]  (value not drawn)
R5  RC1005F103CS  [FP-RC1005-IPC_B]  (value not drawn)
U6  RAA214023GNP#HCA  [L20_3_5x3_5_MFG]

### Ports
VDD (see THE_FIRST[10G], DP10[1B], DP[2B], LDO3.3[1B], ldo[1B], lm334sm[2B]), Vout (see THE_FIRST[9G])

### Nets
GND: C3.2 C4.2 C5.2 C6.2 C7.2 U6.6(100mV) U6.7(200mV) U6.8(GND) U6.18(GND) U6.21(EPAD)
VDD: C5.1 C6.1 U6.14(EN) U6.15(VIN) U6.16(VIN) U6.17(VIN) ; port VDD
VDD1.1: C3.1 C4.1 R5.2 U6.1(VOUT) U6.2(SNS) U6.19(VOUT) U6.20(VOUT) ; port Vout
NetC7_1: C7.1 U6.13(CSET)
NetR5_1: R5.1 U6.4(PG)

Not connected (* = marked no-connect by the designer): U6 3(FB)* 5(50mV)* 9(400mV)* 10(800mV)* 11(1.6V)* 12(NC)*

### Notes on the sheet
- VOLTAGE REF 1.1V

### Library data of the parts
C3 = CMP-13271-002990-1: as C14_22uF on sheet ldo; Case Code (Imperial): 0805; Capacitance: 22uF; Max Operating Temperature: 85°C; Min Operating Temperature: -55°C; Packaging: Tape and Reel; Case Code (Metric): 2012; Case/Package: 0805; Mount: Surface Mount; Tolerance: 20%; Thickness: 0.037inch; Voltage Rating: 16V; Width: 0.049inch; Length: 0.079inch
C4 C7 = CMP-03020-009592-2: as C6_0.1uF on sheet ldo; ComponentLink2Description: Datasheet; Category: Cap; Package: C0805C-DN; Device Class L1: Passive Components; Device Class L3: Ceramic Capacitors; RoHS: TRUE; Height: 0.88mm; Automotive: No; Temperature Range High: +125°C; Octopart: https://octopart.com/c0805c104k4rac-kemet-1343167; Mouser Description: Cap Ceramic 0.1uF 16V X7R 10% Pad SMD 0805 125C Bulk; Lead Free: Yes; Temperature Coefficient: 30ppm/°C; Ipc Land Pattern Name: CAPC200125X78; Manufacturer Part Number: C0805C104K4RAC; Temperature Characteristic: X7R; Device Class L2: Capacitors; Temperature Range Low: -55°C; Temperature: -55°C to +125°C; ComponentLink2URL: https://content.kemet.com/datasheets/KEM_C1003_C0G_SMD.pdf
C5 = CMP-03020-009592-2: as C7_0.1uF on sheet LDO3.3; ComponentLink2Description: Datasheet; Category: Cap; Package: C0805C-DN; Device Class L1: Passive Components; Device Class L3: Ceramic Capacitors; RoHS: TRUE; Height: 0.88mm; Automotive: No; Temperature Range High: +125°C; Octopart: https://octopart.com/c0805c104k4rac-kemet-1343167; Mouser Description: Cap Ceramic 0.1uF 16V X7R 10% Pad SMD 0805 125C Bulk; Lead Free: Yes; Temperature Coefficient: 30ppm/°C; Ipc Land Pattern Name: CAPC200125X78; Manufacturer Part Number: C0805C104K4RAC; Temperature Characteristic: X7R; Device Class L2: Capacitors; Temperature Range Low: -55°C; Temperature: -55°C to +125°C; ComponentLink2URL: https://content.kemet.com/datasheets/KEM_C1003_C0G_SMD.pdf
C6 = CMP-13271-002240-1: as C13_10uF on sheet ldo; Capacitance: 10uF; Case Code (Metric): 2012; Package Quantity: 3000; Width: 0.049inch; Mount: Surface Mount; Depth: 1.25mm; Material: Ceramic; Min Operating Temperature: -55°C; Thickness: 0.053inch; Tolerance: 10%; Case Code (Imperial): 0805; Packaging: Tape and Reel; Voltage Rating: 16V; Case/Package: 0805; Height: 1.25mm; Voltage: 16V; Max Operating Temperature: 85°C; Length: 2mm; Dielectric: X5R
R5 = CMP-13261-004522-1: as R4_10k on sheet ldo; Package Quantity: 1; Depth: 0.5mm; Radiation Hardening: No; Features: Moisture Resistant; Max Operating Temperature: 155°C; Case Code (Metric): 1005; Military Standard: Not; Case/Package: 0402; Width: 0.02inch; Contact Plating: Tin; Mount: Surface Mount; Packaging: Tape and Reel; Height: 0.016inch; Case Code (Imperial): 0402; Number of Terminations: 2; Composition: Thick Film; Temperature Coefficient: 100ppm/°C; Min Operating Temperature: -55°C; Tolerance: 1%; Length: 1mm
U6 = CMP-00572-126438255-2: as U5 on sheet LDO3.3; Case/Package: QFN; Width: 3.5mm; ComponentLink3Description: Manufacturer's Package Drawing; ComponentLink1Description: Manufacturer's Website; HelpURL: https://octopart.com/cad-content/api/get-model-datasheet/15189/126438255; ComponentLink3URL: https://www.renesas.com/en/document/psc/l2035x35-20-lead-quad-flat-no-lead-package-qfn; Height: 900µm; Max Operating Temperature: 85°C; Number of Pins: 20; Max Output Current: 2A; Max Input Voltage: 5.5V; Length: 3.5mm; ComponentLink2URL: https://octopart.com/cad-content/api/get-model-datasheet/15189/126438255; ComponentLink2Description: Datasheet URL; Min Input Voltage: 2.7V; Mount: Surface Mount; Max Output Voltage: 800mV; RoHS: Compliant; ComponentLink1URL: http://www.renesas.com; Min Operating Temperature: -40°C; Lifecycle Status: Production

## Sheet BUFFER_ATOB.SchDoc
size A4; SheetNumber: 8; SheetTotal: 9
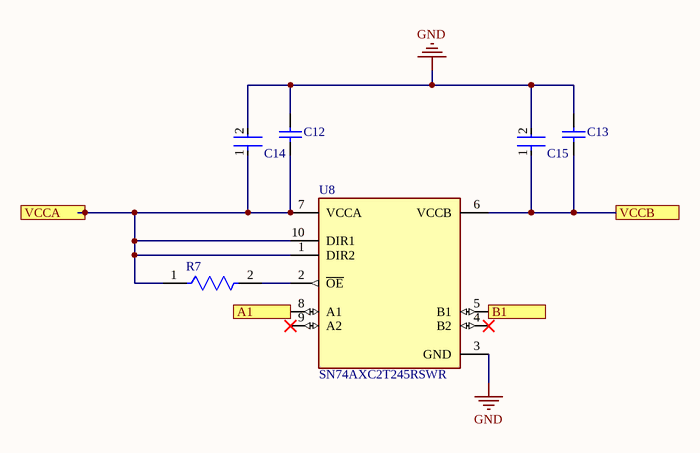
[diagram p10: BUFFER_ATOB.SchDoc]

### Parts
C12  CAP 1uF 16V 0805(2012)  [CAPC0805(2012)100_N]  (value not drawn)
C13  CAP 1uF 16V 0805(2012)  [CAPC0805(2012)100_N]  (value not drawn)
C14  C0805C104K4RAC  [FP-C0805C-DN-MFG]  (value not drawn)
C15  C0805C104K4RAC  [FP-C0805C-DN-MFG]  (value not drawn)
R7  RC0603FR-0710KL  [FP-RC0603-0_55-IPC_C]  (value not drawn)
U8  SN74AXC2T245RSWR  [FP-RSW0010A-MFG]

### Ports
A1 (see THE_FIRST[2D]), B1 (see THE_FIRST[2D]), VCCA (see THE_FIRST[2C], BUFFER_BTOA[1C]), VCCB (see THE_FIRST[2C], BUFFER_BTOA[3C])

### Nets
GND: C12.2 C13.2 C14.2 C15.2 U8.3(GND)
DOUT1A: U8.8(A1) ; port A1
DOUT1B: U8.5(B1) ; port B1
VDD1.1: C12.1 C14.1 R7.1 U8.1(DIR2) U8.7(VCCA) U8.10(DIR1) ; port VCCA
VDD3.3_fpga: C13.1 C15.1 U8.6(VCCB) ; port VCCB
NetR7_2: R7.2 U8.2(~{OE})

Not connected (* = marked no-connect by the designer): U8 4(B2)* 9(A2)*

### Library data of the parts
C12 C13 = CMP-1036-04747-1: CAP 1uF 16V ±10% 0805 (2012 Metric) Thickness 1mm SMD; Manufacturer: KEMET; Manufacturer Part Number: C0805C105K4RACTU; Tolerance: Â±10%; Case-Metric: 2012; Case-EIA: 0805; Dielectric Material: Ceramic; Multilayer: Yes; Temperature Characteristics Code: X7R; Technology: SMT; Value: 1uF; Rated Voltage: 16 V; Max Thickness: 1 mm; Supplier: Digikey; Supplier Part Number: 399-C0805C105K4RACTUCT-ND; RoHS: Yes; Category: Ceramic Capacitors; Stock: 418697; Pricing: 1=0.12, 10=0.068, 100=0.041, 1000=0.03184 (USD); Mounting Technology: Surface Mount; Pins: 2; Package Shape: Rectangular; Case/Package: 0805; Terminal Finish: Nickel; Min Operating Temperature: -55°C; Max Operating Temperature: 125°C; Capacitor Type: Ceramic; Tolerance  (fill in as +-): 10%; Package Style: SMTMeter; Packaging: Tape and Reel; Tolerance (fill in as +-): 10%; Rated DC Voltage (URdc): 16V; Termination: Wraparound; JESD-609 Code: e3; Length: 2mm; Width: 1.25mm; Height: 0.9mm; Reach SVHC Compliant: Yes; RoHS Compliant: Yes; ComponentLink1URL: https://datasheet.ciiva.com:443/pdfs/VipMasterIC/IC/KEME/KEME-S-A0008991654/KEME-S-A0008991654-1.pdf?src-supplier=IHS+Markit; ComponentLink1Description: https://datasheet.ciiva.com:443/pdfs/VipMasterIC/IC/KEME/KEME-S-A0008991654/KEME-S-A0008991654-1.pdf?src-supplier=IHS+Markit
C14 C15 = CMP-03020-009592-2: as C6_0.1uF on sheet ldo; ComponentLink2Description: Datasheet; Category: Cap; Package: C0805C-DN; Device Class L1: Passive Components; Device Class L3: Ceramic Capacitors; RoHS: TRUE; Height: 0.88mm; Automotive: No; Temperature Range High: +125°C; Octopart: https://octopart.com/c0805c104k4rac-kemet-1343167; Mouser Description: Cap Ceramic 0.1uF 16V X7R 10% Pad SMD 0805 125C Bulk; Lead Free: Yes; Temperature Coefficient: 30ppm/°C; Ipc Land Pattern Name: CAPC200125X78; Manufacturer Part Number: C0805C104K4RAC; Temperature Characteristic: X7R; Device Class L2: Capacitors; Temperature Range Low: -55°C; Temperature: -55°C to +125°C; ComponentLink2URL: https://content.kemet.com/datasheets/KEM_C1003_C0G_SMD.pdf
R7 = CMP-2100-03664-2: RES 10K OHM 1% 1/10W 0603; Manufacturer: Yageo; Voltage Rating: 75V; Voltage Rating (DC): 50V; Resistance: 10kR; Power Rating: 100mW; Temperature Coefficient: 100ppm/°C; Value: 10kR; Rated Temperature: 70°C; Temperature Coefficient (ppm/Cel): 100; Additional Feature: LASER TRIMMABLE; Package Height: 0.45mm; Package Length: 1.6mm; Package Width: 0.8mm; Depth: 0.8mm; Termination: SMD/SMT; Resistor Type: Thick Film; Series: RC; Construction: Rectangular; Features: Moisture Resistant; Packaging: Tape and Reel; Min Operating Temperature: -55°C; Number of Terminations: 2; Lead Pitch: 0.3mm; RoHS Compliant: Yes; Case/Package: 0603; Resistance Tolerance: 1%; Military Standard: Not; Weight: 7.1E-05oz; Number of Pins: 2; Tolerance: 1%; Length: 1.6mm; Case Code (Imperial): 0603; Lead Free: Lead Free; Width: 0.8mm; Max Power Dissipation: 100mW; Height: 0.45mm; Max Operating Temperature: 155°C; Case Code (Metric): 1608; Size Code: 0603; Supplier: Digikey; Supplier Part Number: 311-10.0KHRDKR-ND; Manufacturer Part Number: RC0603FR-0710KL; RoHS: Yes; Category: Chip SMD Resistors; Stock: 3719141; Pricing: 1=0.1, 10=0.009, 100=0.0071, 1000=0.0051 (USD); Mounting Technology: Surface Mount; Pins: 2; Terminal Finish: Nickel; Package Shape: Rectangular; JESD-609 Code: e3; Technology: METAL GLAZE/THICK FILM; Power: 100mW; Working Voltage: 75V; Reach SVHC Compliant: Yes; ComponentLink1URL: https://datasheet.ciiva.com:443/pdfs/VipMasterIC/IC/YAGO/YAGO-S-A0008145938/YAGO-S-A0008145938-1.pdf?src-supplier=IHS+Markit; ComponentLink1Description: https://datasheet.ciiva.com:443/pdfs/VipMasterIC/IC/YAGO/YAGO-S-A0008145938/YAGO-S-A0008145938-1.pdf?src-supplier=IHS+Markit
U8 = CMP-04899-000104-1: DUAL-BIT, 2-DIR PIN DUAL-SUPPLY; Manufacturer: Texas Instruments; Supplier: Digikey; Supplier Part Number: 296-SN74AXC2T245RSWRCT-ND; Manufacturer Part Number: SN74AXC2T245RSWR; RoHS: Yes; Category: Voltage Level Shifters; Stock: 32289; Pricing: 1=0.92, 10=0.663, 25=0.5976, 100=0.5256, 250=0.49132, 500=0.47066, 1000=0.46971 (USD); ComponentLink1URL: http://www.ti.com/general/docs/suppproductinfo.tsp?distId=10&amp;gotoUrl=http%3A%2F%2Fwww.ti.com%2Flit%2Fgpn%2FSN74AXC2T245&src-supplier=Digikey; ComponentLink1Description: http://www.ti.com/general/docs/suppproductinfo.tsp?distId=10&amp;gotoUrl=http%3A%2F%2Fwww.ti.com%2Flit%2Fgpn%2FSN74AXC2T245&src-supplier=Digikey